# Altium project ARMflash_revC.PrjPcb (part 1 of 4)
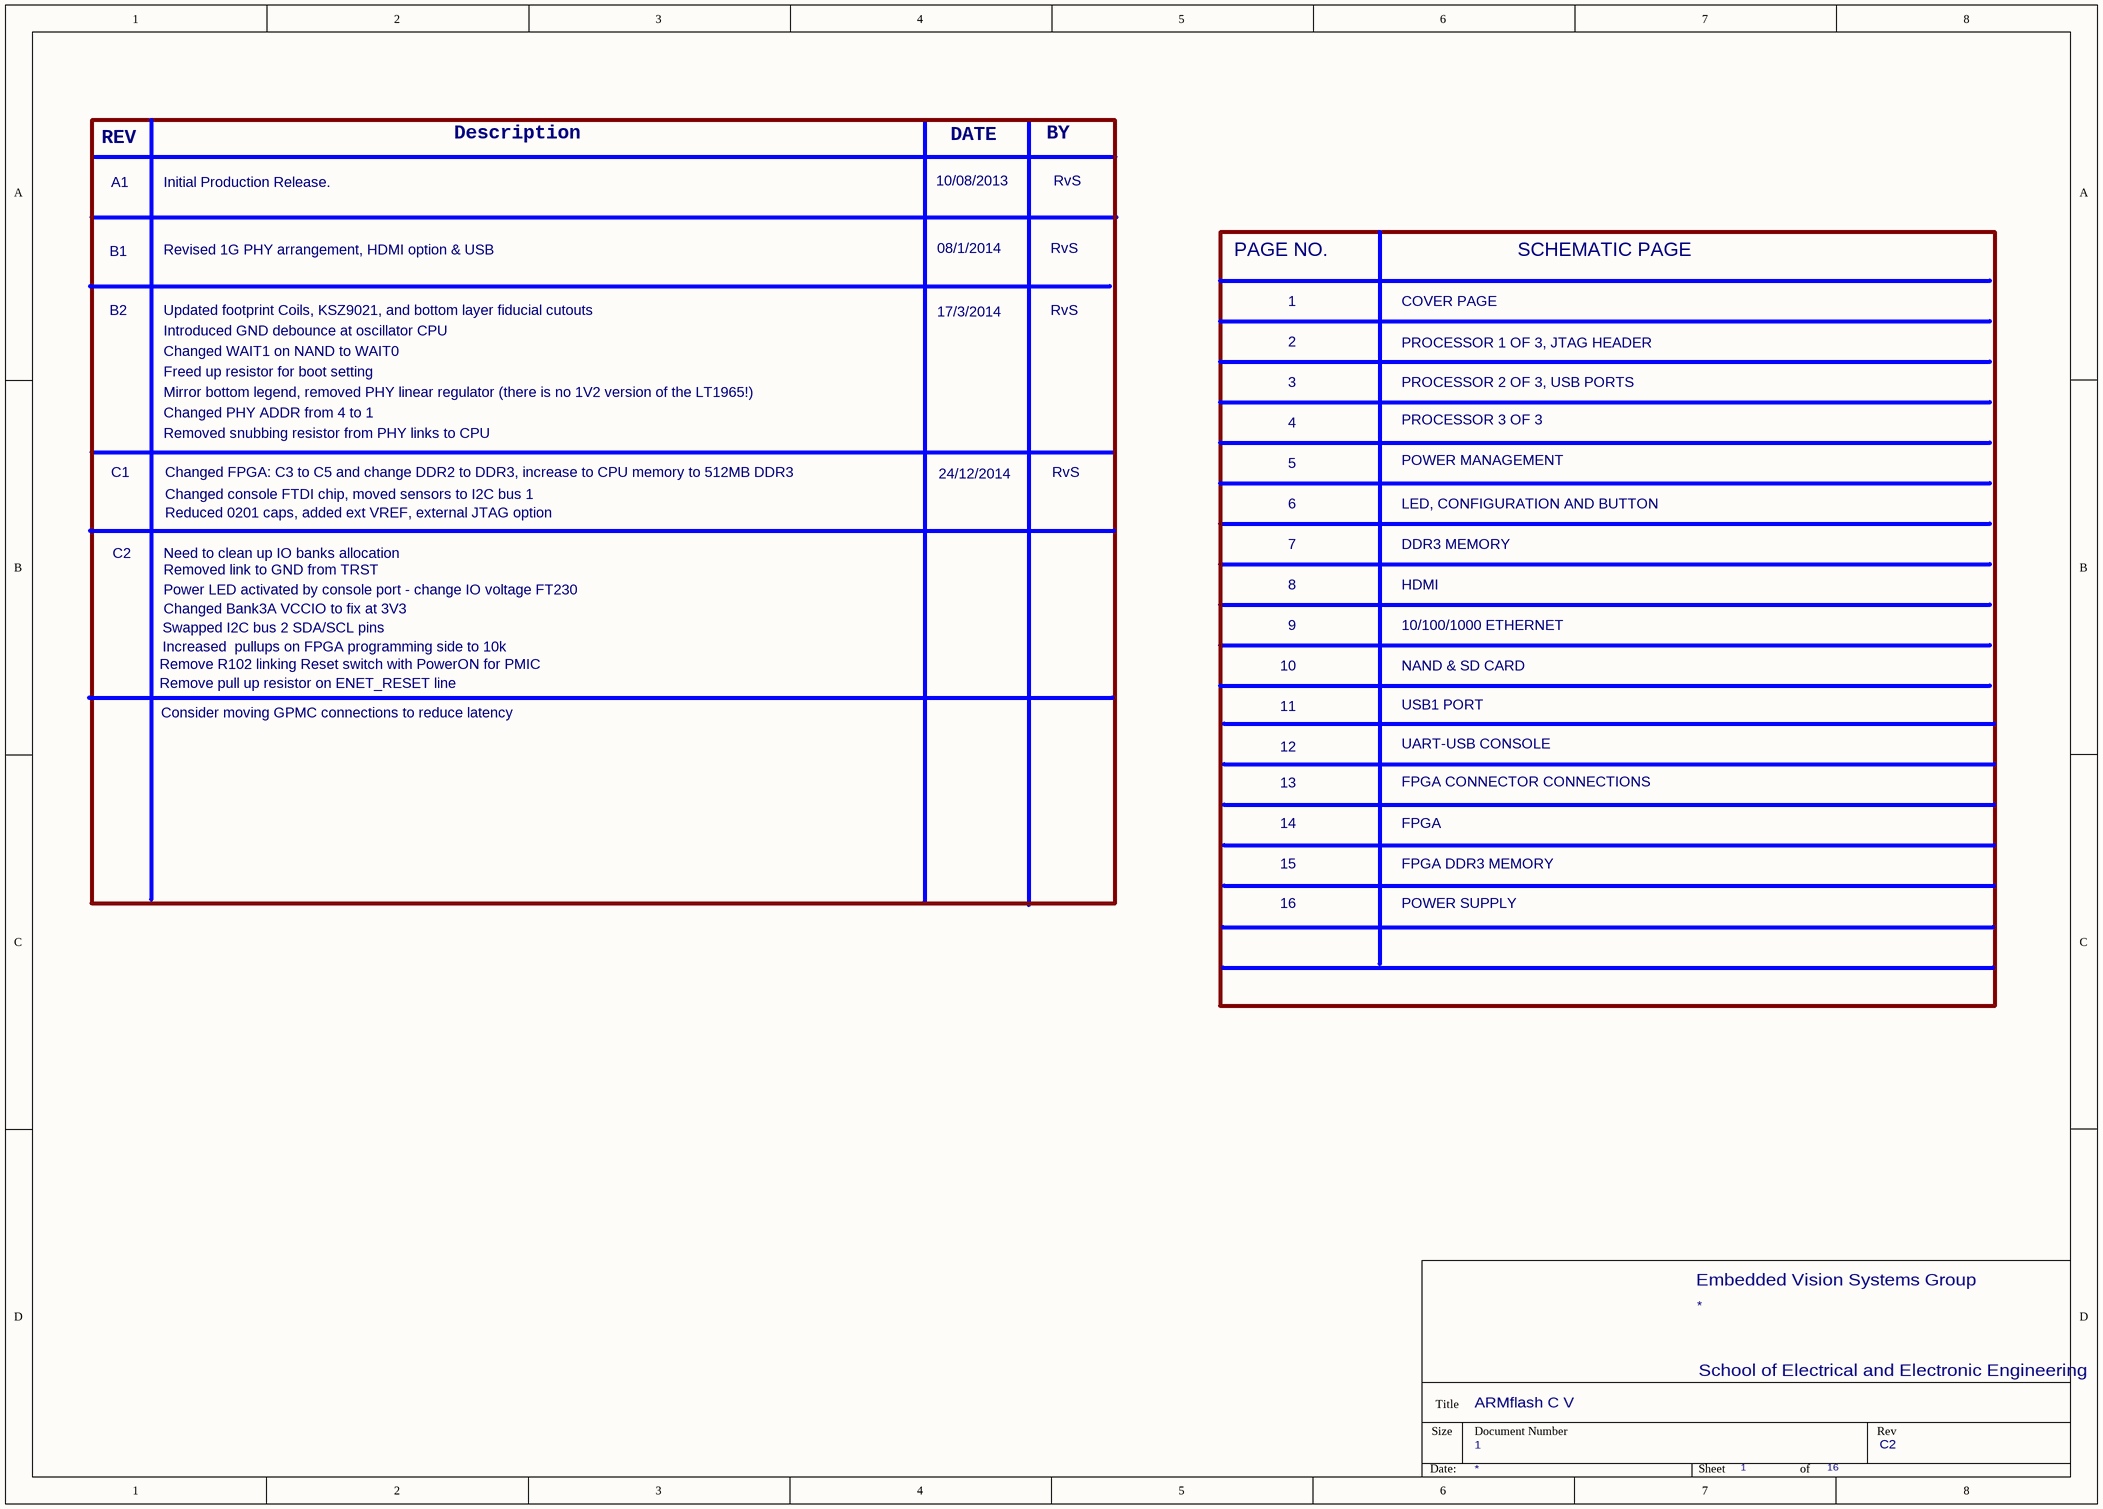
[diagram p0: Pg01_Title Page.SchDoc]
Revision: C2
16 sheets, 607 parts. Net scope: flat (ports and power ports of the same name join across sheets).
Board file: ARMflash_mini_C_V5_1.PcbDoc
Sheets:
  Pg01_Title Page.SchDoc
  Pg02_ AM335X Section 1 .SchDoc
  Pg03_ AM335X Section 2 .SchDoc
  Pg04_ AM335X Section 3 .SchDoc
  Pg05_ Platform_Power.SchDoc
  Pg06_ SysBoot_LEDS_Mech.SchDoc
  Pg07_ DDR3_Memory.SchDoc
  Pg08_HDMI.SchDoc
  Pg09_1G_b.SchDoc
  Pg10_ NAND_SDMMC Interface.SchDoc
  Pg11_ USB1.SchDoc
  Pg12_USB_UART.SchDoc
  Pg13_FPGA_Connectors.SchDoc
  Pg14_FPGA_DDR3.SchDoc
  Pg15_FPGA_5CGX.SchDoc
  Pg16_PSU.SchDoc

## Sheet Pg01_Title Page.SchDoc: ARMflash C V
size A3; DrawnBy: RvS; DocumentNumber: 1; Revision: C2; SheetNumber: 1; SheetTotal: 16

### Parts
(Parts that share a designator on the sheet are numbered #1, #2 ... from top to bottom, then left to right.)
?#1  (no value)  (graphical)

### Notes on the sheet
- REV
- Description
- DATE
- BY
- A1
- Initial Production Release.
- 10/08/2013
- RvS
- B1
- B2
- Revised 1G PHY arrangement, HDMI option & USB
- Updated footprint Coils, KSZ9021, and bottom layer fiducial cutouts
- 08/1/2014
- 17/3/2014
- PAGE NO.
- 1
- COVER PAGE
- SCHEMATIC PAGE
- Freed up resistor for boot setting
- Changed WAIT1 on NAND to WAIT0
- Introduced GND debounce at oscillator CPU
- 2
- PROCESSOR 1 OF 3, JTAG HEADER
- Mirror bottom legend, removed PHY linear regulator (there is no 1V2 version of the LT1965!)
- Changed PHY ADDR from 4 to 1
- Removed snubbing resistor from PHY links to CPU
- 3
- 4
- PROCESSOR 2 OF 3, USB PORTS
- PROCESSOR 3 OF 3
- C1
- Changed FPGA: C3 to C5 and change DDR2 to DDR3, increase to CPU memory to 512MB DDR3
- Changed console FTDI chip, moved sensors to I2C bus 1
- Reduced 0201 caps, added ext VREF, external JTAG option
- 24/12/2014
- 5
- 6
- LED, CONFIGURATION AND BUTTON
- POWER MANAGEMENT
- C2
- Need to clean up IO banks allocation
- Removed link to GND from TRST
- 7
- DDR3 MEMORY
- Swapped I2C bus 2 SDA/SCL pins
- Increased  pullups on FPGA programming side to 10k
- Power LED activated by console port - change IO voltage FT230
- Changed Bank3A VCCIO to fix at 3V3
- 8
- 9
- HDMI
- 10/100/1000 ETHERNET
- Remove R102 linking Reset switch with PowerON for PMIC
- Remove pull up resistor on ENET_RESET line
- Consider moving GPMC connections to reduce latency
- 10
- 11
- NAND & SD CARD
- USB1 PORT
- 12
- 13
- UART-USB CONSOLE
- FPGA CONNECTOR CONNECTIONS
- 14
- FPGA
- 15
- 16
- FPGA DDR3 MEMORY
- POWER SUPPLY
- Embedded Vision Systems Group
- School of Electrical and Electronic Engineering
- Size
- Title
- Document Number
- Rev
- Date:
- Sheet
- of

### Library data of the parts
?#1 = Title Block Address(1): UoM title block

## Sheet Pg02_ AM335X Section 1 .SchDoc: PROCESSOR 1 OF 1
size A2; DrawnBy: RvS; DocumentNumber: 2; Revision: C2; SheetNumber: 2; SheetTotal: 16
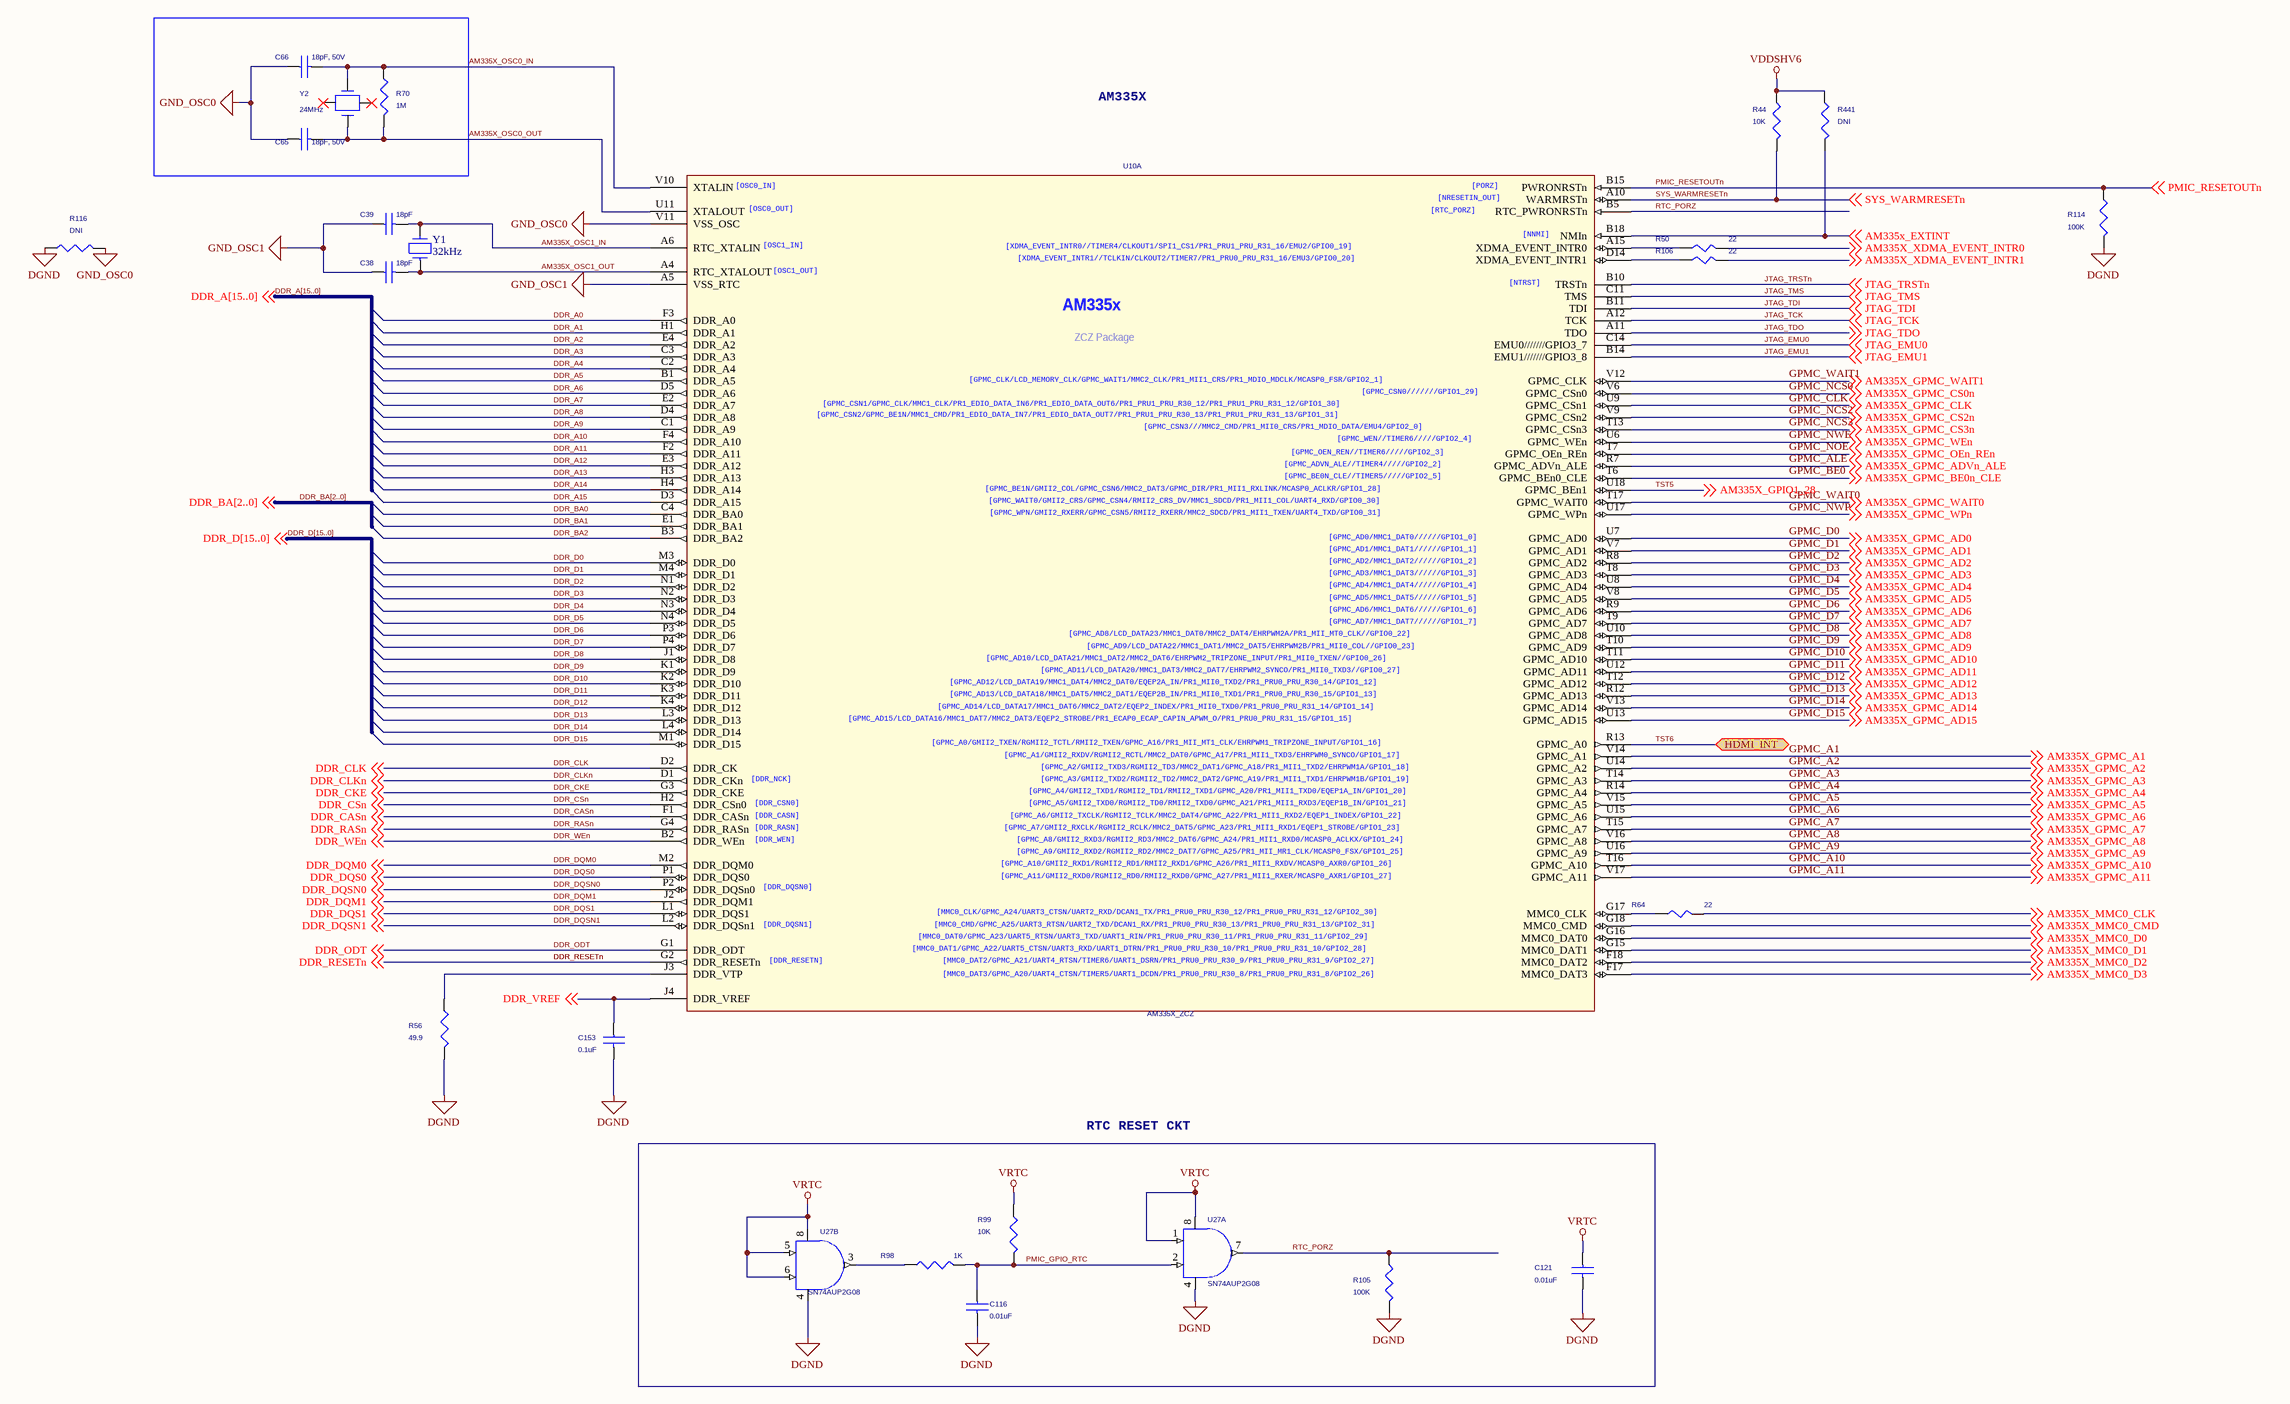
[diagram p1: Pg02_ AM335X Section 1 .SchDoc]

### Parts
(Parts that share a designator on the sheet are numbered #1, #2 ... from top to bottom, then left to right.)
?#2  (no value)  (graphical)
C38  18pF  [SM-7351-CAP-0402]
C39  18pF  [SM-7351-CAP-0402]
C65  18pF, 50V  [SM-7351-CAP-0402]
C66  18pF, 50V  [SM-7351-CAP-0402]
C116  0.01uF  [SM-7351-CAP-0402]
C121  0.01uF  [SM-7351-CAP-0402]
C153  0.1uF  [SM-7351-CAP-0402]
R44  10K  [SM-7351-RES-0402]
R50  22  [SM-7351-RES-0402]
R56  49.9  [smd_melf0102]
R64  22  [SM-7351-RES-0402]
R70  1M  [SM-7351-RES-0402]
R98  1K  [SM-7351-RES-0402]
R99  10K  [SM-7351-RES-0402]
R105  100K  [SM-7351-RES-0402]
R106  22  [SM-7351-RES-0402]
R114  100K  [SM-7351-RES-0402]
R116  DNI  [SM-7351-RES-0402]
R441  DNI  [SM-7351-RES-0402]
U10  AM335X_ZCZ  [BGA15X15-324-55M]  (part A of 3)
U27  SN74AUP2G08  [U_8_DCU]  (parts A,B of 2)
Y1  32kHz  [Xtal 3215]
Y2  24MHz  [XTAL4_3P2X2P5_SMD]

### Blocks framed on the sheet
RTC RESET CKT: C116 C121 R98 R99 R105 U27

### Ports
HDMI_INT

### Nets
DGND: C116.2 C121.2 C153.2 R56.1(P1) R105.1(P1) R114.1(P1) R116.2(P2) U27.4(GND)
GND_OSC0: C65.1 C66.1 R116.1(P1) U10.V11(VSS_OSC)
GND_OSC1: C38.1 C39.1 U10.A5(VSS_RTC)
VDDSHV6: R44.2(P2) R441.2(P2)
VRTC: C121.1 R99.2(P2) U27.1(2A) U27.5(2A) U27.6(2B) U27.8(VCC)  [project net VDDS_RTC]
AM335x_EXTINT: R441.1(P1) U10.B18(NMIn) ; off-sheet AM335x_EXTINT
AM335X_MMC0_CLK: R64.1(P1) ; off-sheet AM335X_MMC0_CLK
AM335X_MMC0_CMD: U10.G18(MMC0_CMD) ; off-sheet AM335X_MMC0_CMD
AM335X_MMC0_D0: U10.G16(MMC0_DAT0) ; off-sheet AM335X_MMC0_D0
AM335X_MMC0_D1: U10.G15(MMC0_DAT1) ; off-sheet AM335X_MMC0_D1
AM335X_MMC0_D2: U10.F18(MMC0_DAT2) ; off-sheet AM335X_MMC0_D2
AM335X_MMC0_D3: U10.F17(MMC0_DAT3) ; off-sheet AM335X_MMC0_D3
AM335X_OSC0_IN: C66.2 R70.2(P2) U10.V10(XTALIN) Y2.3
AM335X_OSC0_OUT: C65.2 R70.1(P1) U10.U11(XTALOUT) Y2.1
AM335X_OSC1_IN: C39.2 U10.A6(RTC_XTALIN) Y1.2
AM335X_OSC1_OUT: C38.2 U10.A4(RTC_XTALOUT) Y1.1
AM335X_XDMA_EVENT_INTR0: R50.1(P1) ; off-sheet AM335X_XDMA_EVENT_INTR0
AM335X_XDMA_EVENT_INTR1: R106.1(P1) ; off-sheet AM335X_XDMA_EVENT_INTR1
DDR_A0: U10.F3(DDR_A0)
DDR_A1: U10.H1(DDR_A1)
DDR_A2: U10.E4(DDR_A2)
DDR_A3: U10.C3(DDR_A3)
DDR_A4: U10.C2(DDR_A4)
DDR_A5: U10.B1(DDR_A5)
DDR_A6: U10.D5(DDR_A6)
DDR_A7: U10.E2(DDR_A7)
DDR_A8: U10.D4(DDR_A8)
DDR_A9: U10.C1(DDR_A9)
DDR_A10: U10.F4(DDR_A10)
DDR_A11: U10.F2(DDR_A11)
DDR_A12: U10.E3(DDR_A12)
DDR_A13: U10.H3(DDR_A13)
DDR_A14: U10.H4(DDR_A14)
DDR_A15: U10.D3(DDR_A15)
DDR_BA0: U10.C4(DDR_BA0)
DDR_BA1: U10.E1(DDR_BA1)
DDR_BA2: U10.B3(DDR_BA2)
DDR_CASn: U10.F1(DDR_CASn) ; off-sheet DDR_CASn
DDR_CKE: U10.G3(DDR_CKE) ; off-sheet DDR_CKE
DDR_CLK: U10.D2(DDR_CK) ; off-sheet DDR_CLK
DDR_CLKn: U10.D1(DDR_CKn) ; off-sheet DDR_CLKn
DDR_CSn: U10.H2(DDR_CSn0) ; off-sheet DDR_CSn
DDR_D0: U10.M3(DDR_D0)
DDR_D1: U10.M4(DDR_D1)
DDR_D2: U10.N1(DDR_D2)
DDR_D3: U10.N2(DDR_D3)
DDR_D4: U10.N3(DDR_D4)
DDR_D5: U10.N4(DDR_D5)
DDR_D6: U10.P3(DDR_D6)
DDR_D7: U10.P4(DDR_D7)
DDR_D8: U10.J1(DDR_D8)
DDR_D9: U10.K1(DDR_D9)
DDR_D10: U10.K2(DDR_D10)
DDR_D11: U10.K3(DDR_D11)
DDR_D12: U10.K4(DDR_D12)
DDR_D13: U10.L3(DDR_D13)
DDR_D14: U10.L4(DDR_D14)
DDR_D15: U10.M1(DDR_D15)
DDR_DQM0: U10.M2(DDR_DQM0) ; off-sheet DDR_DQM0
DDR_DQM1: U10.J2(DDR_DQM1) ; off-sheet DDR_DQM1
DDR_DQS0: U10.P1(DDR_DQS0) ; off-sheet DDR_DQS0
DDR_DQS1: U10.L1(DDR_DQS1) ; off-sheet DDR_DQS1
DDR_DQSN0: U10.P2(DDR_DQSn0) ; off-sheet DDR_DQSN0
DDR_DQSN1: U10.L2(DDR_DQSn1) ; off-sheet DDR_DQSN1
DDR_ODT: U10.G1(DDR_ODT) ; off-sheet DDR_ODT
DDR_RASn: U10.G4(DDR_RASn) ; off-sheet DDR_RASn
DDR_RESETn: U10.G2(DDR_RESETn) ; off-sheet DDR_RESETn
DDR_VREF: C153.1 U10.J4(DDR_VREF) ; off-sheet DDR_VREF
DDR_WEn: U10.B2(DDR_WEn) ; off-sheet DDR_WEn
GPMC_A1: U10.V14(GPMC_A1) ; off-sheet AM335X_GPMC_A1  [also labelled AM335X_GPMC_A1]
GPMC_A2: U10.U14(GPMC_A2) ; off-sheet AM335X_GPMC_A2  [also labelled AM335X_GPMC_A2]
GPMC_A3: U10.T14(GPMC_A3) ; off-sheet AM335X_GPMC_A3  [also labelled AM335X_GPMC_A3]
GPMC_A4: U10.R14(GPMC_A4) ; off-sheet AM335X_GPMC_A4  [also labelled AM335X_GPMC_A4]
GPMC_A5: U10.V15(GPMC_A5) ; off-sheet AM335X_GPMC_A5  [also labelled AM335X_GPMC_A5]
GPMC_A6: U10.U15(GPMC_A6) ; off-sheet AM335X_GPMC_A6  [also labelled AM335X_GPMC_A6]
GPMC_A7: U10.T15(GPMC_A7) ; off-sheet AM335X_GPMC_A7  [also labelled AM335X_GPMC_A7]
GPMC_A8: U10.V16(GPMC_A8) ; off-sheet AM335X_GPMC_A8  [also labelled AM335X_GPMC_A8]
GPMC_A9: U10.U16(GPMC_A9) ; off-sheet AM335X_GPMC_A9  [also labelled AM335X_GPMC_A9]
GPMC_A10: U10.T16(GPMC_A10) ; off-sheet AM335X_GPMC_A10  [also labelled AM335X_GPMC_A10]
GPMC_A11: U10.V17(GPMC_A11) ; off-sheet AM335X_GPMC_A11  [also labelled AM335X_GPMC_A11]
GPMC_ALE: U10.R7(GPMC_ADVn_ALE) ; off-sheet AM335X_GPMC_ADVn_ALE  [also labelled AM335X_GPMC_ADVn_ALE]
GPMC_BE0: U10.T6(GPMC_BEn0_CLE) ; off-sheet AM335X_GPMC_BE0n_CLE  [also labelled AM335X_GPMC_BE0n_CLE]
GPMC_CLK: U10.U9(GPMC_CSn1) ; off-sheet AM335X_GPMC_CLK  [also labelled AM335X_GPMC_CLK]
GPMC_D0: U10.U7(GPMC_AD0) ; off-sheet AM335X_GPMC_AD0  [also labelled AM335X_GPMC_AD0]
GPMC_D1: U10.V7(GPMC_AD1) ; off-sheet AM335X_GPMC_AD1  [also labelled AM335X_GPMC_AD1]
GPMC_D2: U10.R8(GPMC_AD2) ; off-sheet AM335X_GPMC_AD2  [also labelled AM335X_GPMC_AD2]
GPMC_D3: U10.T8(GPMC_AD3) ; off-sheet AM335X_GPMC_AD3  [also labelled AM335X_GPMC_AD3]
GPMC_D4: U10.U8(GPMC_AD4) ; off-sheet AM335X_GPMC_AD4  [also labelled AM335X_GPMC_AD4]
GPMC_D5: U10.V8(GPMC_AD5) ; off-sheet AM335X_GPMC_AD5  [also labelled AM335X_GPMC_AD5]
GPMC_D6: U10.R9(GPMC_AD6) ; off-sheet AM335X_GPMC_AD6  [also labelled AM335X_GPMC_AD6]
GPMC_D7: U10.T9(GPMC_AD7) ; off-sheet AM335X_GPMC_AD7  [also labelled AM335X_GPMC_AD7]
GPMC_D8: U10.U10(GPMC_AD8) ; off-sheet AM335X_GPMC_AD8  [also labelled AM335X_GPMC_AD8]
GPMC_D9: U10.T10(GPMC_AD9) ; off-sheet AM335X_GPMC_AD9  [also labelled AM335X_GPMC_AD9]
GPMC_D10: U10.T11(GPMC_AD10) ; off-sheet AM335X_GPMC_AD10  [also labelled AM335X_GPMC_AD10]
GPMC_D11: U10.U12(GPMC_AD11) ; off-sheet AM335X_GPMC_AD11  [also labelled AM335X_GPMC_AD11]
GPMC_D12: U10.T12(GPMC_AD12) ; off-sheet AM335X_GPMC_AD12  [also labelled AM335X_GPMC_AD12]
GPMC_D13: U10.R12(GPMC_AD13) ; off-sheet AM335X_GPMC_AD13  [also labelled AM335X_GPMC_AD13]
GPMC_D14: U10.V13(GPMC_AD14) ; off-sheet AM335X_GPMC_AD14  [also labelled AM335X_GPMC_AD14]
GPMC_D15: U10.U13(GPMC_AD15) ; off-sheet AM335X_GPMC_AD15  [also labelled AM335X_GPMC_AD15]
GPMC_NCS0: U10.V6(GPMC_CSn0) ; off-sheet AM335X_GPMC_CS0n  [also labelled AM335X_GPMC_CS0n]
GPMC_NCS2: U10.V9(GPMC_CSn2) ; off-sheet AM335X_GPMC_CS2n  [also labelled AM335X_GPMC_CS2n]
GPMC_NCS3: U10.T13(GPMC_CSn3) ; off-sheet AM335X_GPMC_CS3n  [also labelled AM335X_GPMC_CS3n]
GPMC_NOE: U10.T7(GPMC_OEn_REn) ; off-sheet AM335X_GPMC_OEn_REn  [also labelled AM335X_GPMC_OEn_REn]
GPMC_NWE: U10.U6(GPMC_WEn) ; off-sheet AM335X_GPMC_WEn  [also labelled AM335X_GPMC_WEn]
GPMC_NWP: U10.U17(GPMC_WPn) ; off-sheet AM335X_GPMC_WPn  [also labelled AM335X_GPMC_WPn]
GPMC_WAIT0: U10.T17(GPMC_WAIT0) ; off-sheet AM335X_GPMC_WAIT0  [also labelled AM335X_GPMC_WAIT0]
GPMC_WAIT1: U10.V12(GPMC_CLK) ; off-sheet AM335X_GPMC_WAIT1  [also labelled AM335X_GPMC_WAIT1]
JTAG_EMU0: U10.C14(EMU0///////GPIO3_7) ; off-sheet JTAG_EMU0
JTAG_EMU1: U10.B14(EMU1///////GPIO3_8) ; off-sheet JTAG_EMU1
JTAG_TCK: U10.A12(TCK) ; off-sheet JTAG_TCK
JTAG_TDI: U10.B11(TDI) ; off-sheet JTAG_TDI
JTAG_TDO: U10.A11(TDO) ; off-sheet JTAG_TDO
JTAG_TMS: U10.C11(TMS) ; off-sheet JTAG_TMS
JTAG_TRSTn: U10.B10(TRSTn) ; off-sheet JTAG_TRSTn
PMIC_GPIO_RTC: C116.1 R98.1(P1) R99.1(P1) U27.2(2B)
PMIC_RESETOUTn: R114.2(P2) U10.B15(PWRONRSTn) ; off-sheet PMIC_RESETOUTn
RTC_PORZ: R105.2(P2) U10.B5(RTC_PWRONRSTn) U27.7(2Y)
SYS_WARMRESETn: R44.1(P1) U10.A10(WARMRSTn) ; off-sheet SYS_WARMRESETn  [project net ENET_RESETn]
TST5: U10.U18(GPMC_BEn1) ; off-sheet AM335X_GPIO1_28  [also labelled AM335X_GPIO1_28]
TST6: U10.R13(GPMC_A0) ; port HDMI_INT
NetR50_2: R50.2(P2) U10.A15(XDMA_EVENT_INTR0)
NetR56_2: R56.2(P2) U10.J3(DDR_VTP)
NetR64_2: R64.2(P2) U10.G17(MMC0_CLK)
NetR98_2: R98.2(P2) U27.3(2Y)
NetR106_2: R106.2(P2) U10.D14(XDMA_EVENT_INTR1)

Not connected (* = marked no-connect by the designer): Y2 2(NC0)* 4(NC1)*

### Buses and harness runs
bus DDR_A[15..0]
bus DDR_BA[2..0]
bus DDR_D[15..0]

### Notes on the sheet
- AM335X
- Embedded Vision Systems Group
- Title
- School of Electrical and Electronic Engineering
- Date:
- Size
- Document Number
- Sheet
- of
- Rev
- (in symbol AM335X_15mmx15mm, part A) [OSC0_IN]; [PORZ]; [NRESETIN_OUT]; [OSC0_OUT]; [RTC_PORZ]; [NNMI]; [OSC1_IN]; [XDMA_EVENT_INTR0//TIMER4/CLKOUT1/SPI1_CS1/PR1_PRU1_PRU_R31_16/EMU2/GPIO0_19]; [XDMA_EVENT_INTR1//TCLKIN/CLKOUT2/TIMER7/PR1_PRU0_PRU_R31_16/EMU3/GPIO0_20]; [OSC1_OUT]; [NTRST]; AM335x; ZCZ Package; [GPMC_CLK/LCD_MEMORY_CLK/GPMC_WAIT1/MMC2_CLK/PR1_MII1_CRS/PR1_MDIO_MDCLK/MCASP0_FSR/GPIO2_1]; [GPMC_CSN0///////GPIO1_29]; [GPMC_CSN1/GPMC_CLK/MMC1_CLK/PR1_EDIO_DATA_IN6/PR1_EDIO_DATA_OUT6/PR1_PRU1_PRU_R30_12/PR1_PRU1_PRU_R31_12/GPIO1_30]; [GPMC_CSN2/GPMC_BE1N/MMC1_CMD/PR1_EDIO_DATA_IN7/PR1_EDIO_DATA_OUT7/PR1_PRU1_PRU_R30_13/PR1_PRU1_PRU_R31_13/GPIO1_31]; [GPMC_CSN3///MMC2_CMD/PR1_MII0_CRS/PR1_MDIO_DATA/EMU4/GPIO2_0]; [GPMC_WEN//TIMER6/////GPIO2_4]; [GPMC_OEN_REN//TIMER6/////GPIO2_3]; [GPMC_ADVN_ALE//TIMER4/////GPIO2_2]; [GPMC_BE0N_CLE//TIMER5/////GPIO2_5]; [GPMC_BE1N/GMII2_COL/GPMC_CSN6/MMC2_DAT3/GPMC_DIR/PR1_MII1_RXLINK/MCASP0_ACLKR/GPIO1_28]; [GPMC_WAIT0/GMII2_CRS/GPMC_CSN4/RMII2_CRS_DV/MMC1_SDCD/PR1_MII1_COL/UART4_RXD/GPIO0_30]; [GPMC_WPN/GMII2_RXERR/GPMC_CSN5/RMII2_RXERR/MMC2_SDCD/PR1_MII1_TXEN/UART4_TXD/GPIO0_31]; [GPMC_AD0/MMC1_DAT0//////GPIO1_0]; [GPMC_AD1/MMC1_DAT1//////GPIO1_1]; [GPMC_AD2/MMC1_DAT2//////GPIO1_2]; [GPMC_AD3/MMC1_DAT3//////GPIO1_3]; [GPMC_AD4/MMC1_DAT4//////GPIO1_4]; [GPMC_AD5/MMC1_DAT5//////GPIO1_5]; [GPMC_AD6/MMC1_DAT6//////GPIO1_6]; [GPMC_AD7/MMC1_DAT7//////GPIO1_7]; [GPMC_AD8/LCD_DATA23/MMC1_DAT0/MMC2_DAT4/EHRPWM2A/PR1_MII_MT0_CLK//GPIO0_22]; [GPMC_AD9/LCD_DATA22/MMC1_DAT1/MMC2_DAT5/EHRPWM2B/PR1_MII0_COL//GPIO0_23]; [GPMC_AD10/LCD_DATA21/MMC1_DAT2/MMC2_DAT6/EHRPWM2_TRIPZONE_INPUT/PR1_MII0_TXEN//GPIO0_26]; [GPMC_AD11/LCD_DATA20/MMC1_DAT3/MMC2_DAT7/EHRPWM2_SYNCO/PR1_MII0_TXD3//GPIO0_27]; [GPMC_AD12/LCD_DATA19/MMC1_DAT4/MMC2_DAT0/EQEP2A_IN/PR1_MII0_TXD2/PR1_PRU0_PRU_R30_14/GPIO1_12]; [GPMC_AD13/LCD_DATA18/MMC1_DAT5/MMC2_DAT1/EQEP2B_IN/PR1_MII0_TXD1/PR1_PRU0_PRU_R30_15/GPIO1_13]; [GPMC_AD14/LCD_DATA17/MMC1_DAT6/MMC2_DAT2/EQEP2_INDEX/PR1_MII0_TXD0/PR1_PRU0_PRU_R31_14/GPIO1_14]; [GPMC_AD15/LCD_DATA16/MMC1_DAT7/MMC2_DAT3/EQEP2_STROBE/PR1_ECAP0_ECAP_CAPIN_APWM_O/PR1_PRU0_PRU_R31_15/GPIO1_15]; [GPMC_A0/GMII2_TXEN/RGMII2_TCTL/RMII2_TXEN/GPMC_A16/PR1_MII_MT1_CLK/EHRPWM1_TRIPZONE_INPUT/GPIO1_16]; [GPMC_A1/GMII2_RXDV/RGMII2_RCTL/MMC2_DAT0/GPMC_A17/PR1_MII1_TXD3/EHRPWM0_SYNCO/GPIO1_17]; [GPMC_A2/GMII2_TXD3/RGMII2_TD3/MMC2_DAT1/GPMC_A18/PR1_MII1_TXD2/EHRPWM1A/GPIO1_18]; [DDR_NCK]; [GPMC_A3/GMII2_TXD2/RGMII2_TD2/MMC2_DAT2/GPMC_A19/PR1_MII1_TXD1/EHRPWM1B/GPIO1_19]; [GPMC_A4/GMII2_TXD1/RGMII2_TD1/RMII2_TXD1/GPMC_A20/PR1_MII1_TXD0/EQEP1A_IN/GPIO1_20]; [DDR_CSN0]; [GPMC_A5/GMII2_TXD0/RGMII2_TD0/RMII2_TXD0/GPMC_A21/PR1_MII1_RXD3/EQEP1B_IN/GPIO1_21]; [DDR_CASN]; [GPMC_A6/GMII2_TXCLK/RGMII2_TCLK/MMC2_DAT4/GPMC_A22/PR1_MII1_RXD2/EQEP1_INDEX/GPIO1_22]; [DDR_RASN]; [GPMC_A7/GMII2_RXCLK/RGMII2_RCLK/MMC2_DAT5/GPMC_A23/PR1_MII1_RXD1/EQEP1_STROBE/GPIO1_23]; [DDR_WEN]; [GPMC_A8/GMII2_RXD3/RGMII2_RD3/MMC2_DAT6/GPMC_A24/PR1_MII1_RXD0/MCASP0_ACLKX/GPIO1_24]; [GPMC_A9/GMII2_RXD2/RGMII2_RD2/MMC2_DAT7/GPMC_A25/PR1_MII_MR1_CLK/MCASP0_FSX/GPIO1_25]; [GPMC_A10/GMII2_RXD1/RGMII2_RD1/RMII2_RXD1/GPMC_A26/PR1_MII1_RXDV/MCASP0_AXR0/GPIO1_26]; [GPMC_A11/GMII2_RXD0/RGMII2_RD0/RMII2_RXD0/GPMC_A27/PR1_MII1_RXER/MCASP0_AXR1/GPIO1_27]; [DDR_DQSN0]; [MMC0_CLK/GPMC_A24/UART3_CTSN/UART2_RXD/DCAN1_TX/PR1_PRU0_PRU_R30_12/PR1_PRU0_PRU_R31_12/GPIO2_30]; [DDR_DQSN1]; [MMC0_CMD/GPMC_A25/UART3_RTSN/UART2_TXD/DCAN1_RX/PR1_PRU0_PRU_R30_13/PR1_PRU0_PRU_R31_13/GPIO2_31]; [MMC0_DAT0/GPMC_A23/UART5_RTSN/UART3_TXD/UART1_RIN/PR1_PRU0_PRU_R30_11/PR1_PRU0_PRU_R31_11/GPIO2_29]; [MMC0_DAT1/GPMC_A22/UART5_CTSN/UART3_RXD/UART1_DTRN/PR1_PRU0_PRU_R30_10/PR1_PRU0_PRU_R31_10/GPIO2_28]; [DDR_RESETN]; [MMC0_DAT2/GPMC_A21/UART4_RTSN/TIMER6/UART1_DSRN/PR1_PRU0_PRU_R30_9/PR1_PRU0_PRU_R31_9/GPIO2_27]; [MMC0_DAT3/GPMC_A20/UART4_CTSN/TIMER5/UART1_DCDN/PR1_PRU0_PRU_R30_8/PR1_PRU0_PRU_R31_8/GPIO2_26]

### Library data of the parts
?#2 = Title Block Address(1): UoM title block
C38 C39 = 22pFCapacitor50V10%SMD0402: Capacitor 22pF 50V 10% 0402; PartName: 22pF50V10%SMD0402; Mfr: Panasonic; MfrNum: ECJ-0EC1H220J; TIIntPartnumber: 1C0020; Vendor: Digikey; Cost100: 0.1678; DescriptiveText: Capacitor 22pF 50V 10% 0402; Cost10K: 0.1678; Descriptive_Text: Capacitor 22pF 50V 10% 0402
C65 C66 = 18pFCapacitor50V5%0402: PartName: 18pF50V5%SMD0402; Mfr: TDK; MfrNum: CGA2B2C0G1H180J; TIIntPartnumber: 1C0119; Vendor: Mouser; Cost100: 0.19; Cost10K: 0.045; DescriptiveText: Capacitor NPO 18pF 50V 5% 0402
C116 C121 = 0.01uFCapacitor16V10%0402: Mfr: Panasonic; PartName: 0.01uF16V10%SMD0402; MfrNum: ECJ-0YB1C103K; TIIntPartnumber: 1C0012; PN: 0402YC103KAT2A; TN: 207-0054-000; Vendor: Digikey; Cost100: 0.00; Cost10K: 0.015; DescriptiveText: Capacitor 0.01uF 16V 10% 0402
C153 = 0.1uFCapacitor16V10%0402_Dup1: TIIntPartnumber: 1C0089; MfrNum: C0402C104K4RACT; Mfr: Kemet; PartName: 0.1uF16V10%SMD0402; DescriptiveText: Capacitor 0.1uF 16V 10% 0402 X7R; Cost10K: 0.015; Cost100: 0.11; Vendor: Digikey
R44 R441 = 10KOhmResistor1/16W0402_Dup1: Resistor 10Kohm 1/16W 5% 0402; TIIntPartnumber: 1R0168; MfrNum: MCR01MZPJ103; Mfr: Rohm; PartName: 10Kohm1/16W5%SMD0402; Cost10K: 0.0017; Cost100: 0.03; Vendor: Digikey; Descriptive_Text: Resistor 10Kohm 1/16W 5% 0402; DescriptiveText: Resistor 10Kohm 1/16W 5% 0402
R50 R64 R106 = 22OhmResistor1/16W1%0402: Resistor 22 ohm 1/16W 1% 0402; PartName: 22ohm1/161%smd0402; Mfr: ROHM; MfrNum: MCR01MZPF22R0; TIIntPartnumber: 1R0175; Vendor: Digikey; Cost100: 0.069; Cost10K: 0.00529; DescriptiveText: Resistor 22 ohm 1/16W 1% 0402; Descriptive_Text: Resistor 22 ohm 1/16W 1% 0402
R56 = 49.9ohm1/3W1%SMDMELF0102: Mfr: Vishay; MfrNum: MMU01020C4999FB300; TIIntPartnumber: 1R0243; DescriptiveText: MELF Resistor 49.9ohm 1/3W 1% MELF0102; Vendor: Digikey; Cost100: 0.0105; Cost10K: 0.00275; PartName: 49.9ohm1/3W1%smdMELF0102
R70 R116 = 1MOhmResistor1/16W0402: PartName: 1Mohm1/16W1%SMD0402; Mfr: Stackpole Electronics; MfrNum: RMCF0402FT1M00; TIIntPartnumber: 1R0182; Vendor: Digikey; Cost100: 0.0105; Cost10K: 0.00275; DescriptiveText: Resistor 1Mohm 1/16W 1% 0402
R98 = 1KOhmResistor1/16W0402: Resistor 1Kohm 1/16W 5% 0402; PartName: 1KOHM1/16W5%SMD; Mfr: Panasonic; MfrNum: ERJ-2GEJ102X; TIIntPartnumber: 1R0027; Vendor: DIGIKEY; Cost100: 0.02595; Descriptive_Text: Resistor 1Kohm 1/16W 5% 0402; Cost10K: 0.02595; DescriptiveText: Resistor 1Kohm 1/16W 5% 0402
R99 = 10KOhmResistor1/16W0402: Resistor 10Kohm 1/16W 5% 0402; PartName: 10Kohm1/16W5%SMD0402; Mfr: Rohm; MfrNum: MCR01MZPJ103; TIIntPartnumber: 1R0168; Vendor: DIGIKEY; Cost100: 0.03; Cost10K: 0.0017; DescriptiveText: Resistor 10Kohm 1/16W 5% 0402; Descriptive_Text: Resistor 10Kohm 1/16W 5% 0402
R105 R114 = 100KOhmResistor1/16W0402: TIIntPartnumber: 1R0181; MfrNum: RMCF0402FT100K; Mfr: Stackpole Electronics; PartName: 100Kohm1/16W1%SMD0402; DescriptiveText: Resistor 100Kohm 1/16W 1% 0402; Cost10K: 0.0020; Cost100: 0.0105; Vendor: DIGIKEY
U10 = AM335X_15mmx15mm: TIIntPartnumber: 1A0242; MfrNum: XAM3359ZCZ; Mfr: TI; PartName: AM335X_15x15; Cost10K: 4.1; Cost100: 10.00; Vendor: Arrow; DescriptiveText: ARM MPU Cortex A8 Processor ZCZ Package
U27 = SN74AUP2G08: Low Power Dual AND Gate; TIIntPartnumber: 1A0249; MfrNum: SN74AUP2G08DCU; Mfr: TI; Cost10K: 0.1710; Cost100: 0.11; Vendor: Digikey; Descriptive_Text: Low Power Dual AND Gate; PartName: SN74AUP2G08; DescriptiveText: Low Power Dual AND Gate
Y1 = CRYSTAL
Y2 = Crystal24MHz18PFsmd_0: PartName: Crystal24MHz3.2x2.5; Mfr: Citizen; MfrNum: CS325-24.000MABJ-UT; TIIntPartnumber: 1Y0039; DescriptiveText: Crystal 24MHz 30ppm load cap 18pF; Vendor: Digikey; Cost100: 0.56; Cost10K: 0.50

## Sheet Pg03_ AM335X Section 2 .SchDoc: PROCESSOR 2 OF 3
size A2; DrawnBy: RvS; DocumentNumber: 3; Revision: C2; SheetNumber: 3; SheetTotal: 16; PageSetup: Record=PageOptions|CenterHorizontal=True|CenterVertical=True|PrintScale=0.51|XCorrection=1.00|YCorrection=1.00|PrintKind=1|BorderSize=5000000|LeftOffset=0|BottomOffset=0|Orientation=2|PaperLength=1000|PaperWidth=1000|Scale=100|PaperSource=15|PrintQuality=600|MediaType=1|DitherType=10|PaperKind=A4|PrintScaleMode=1
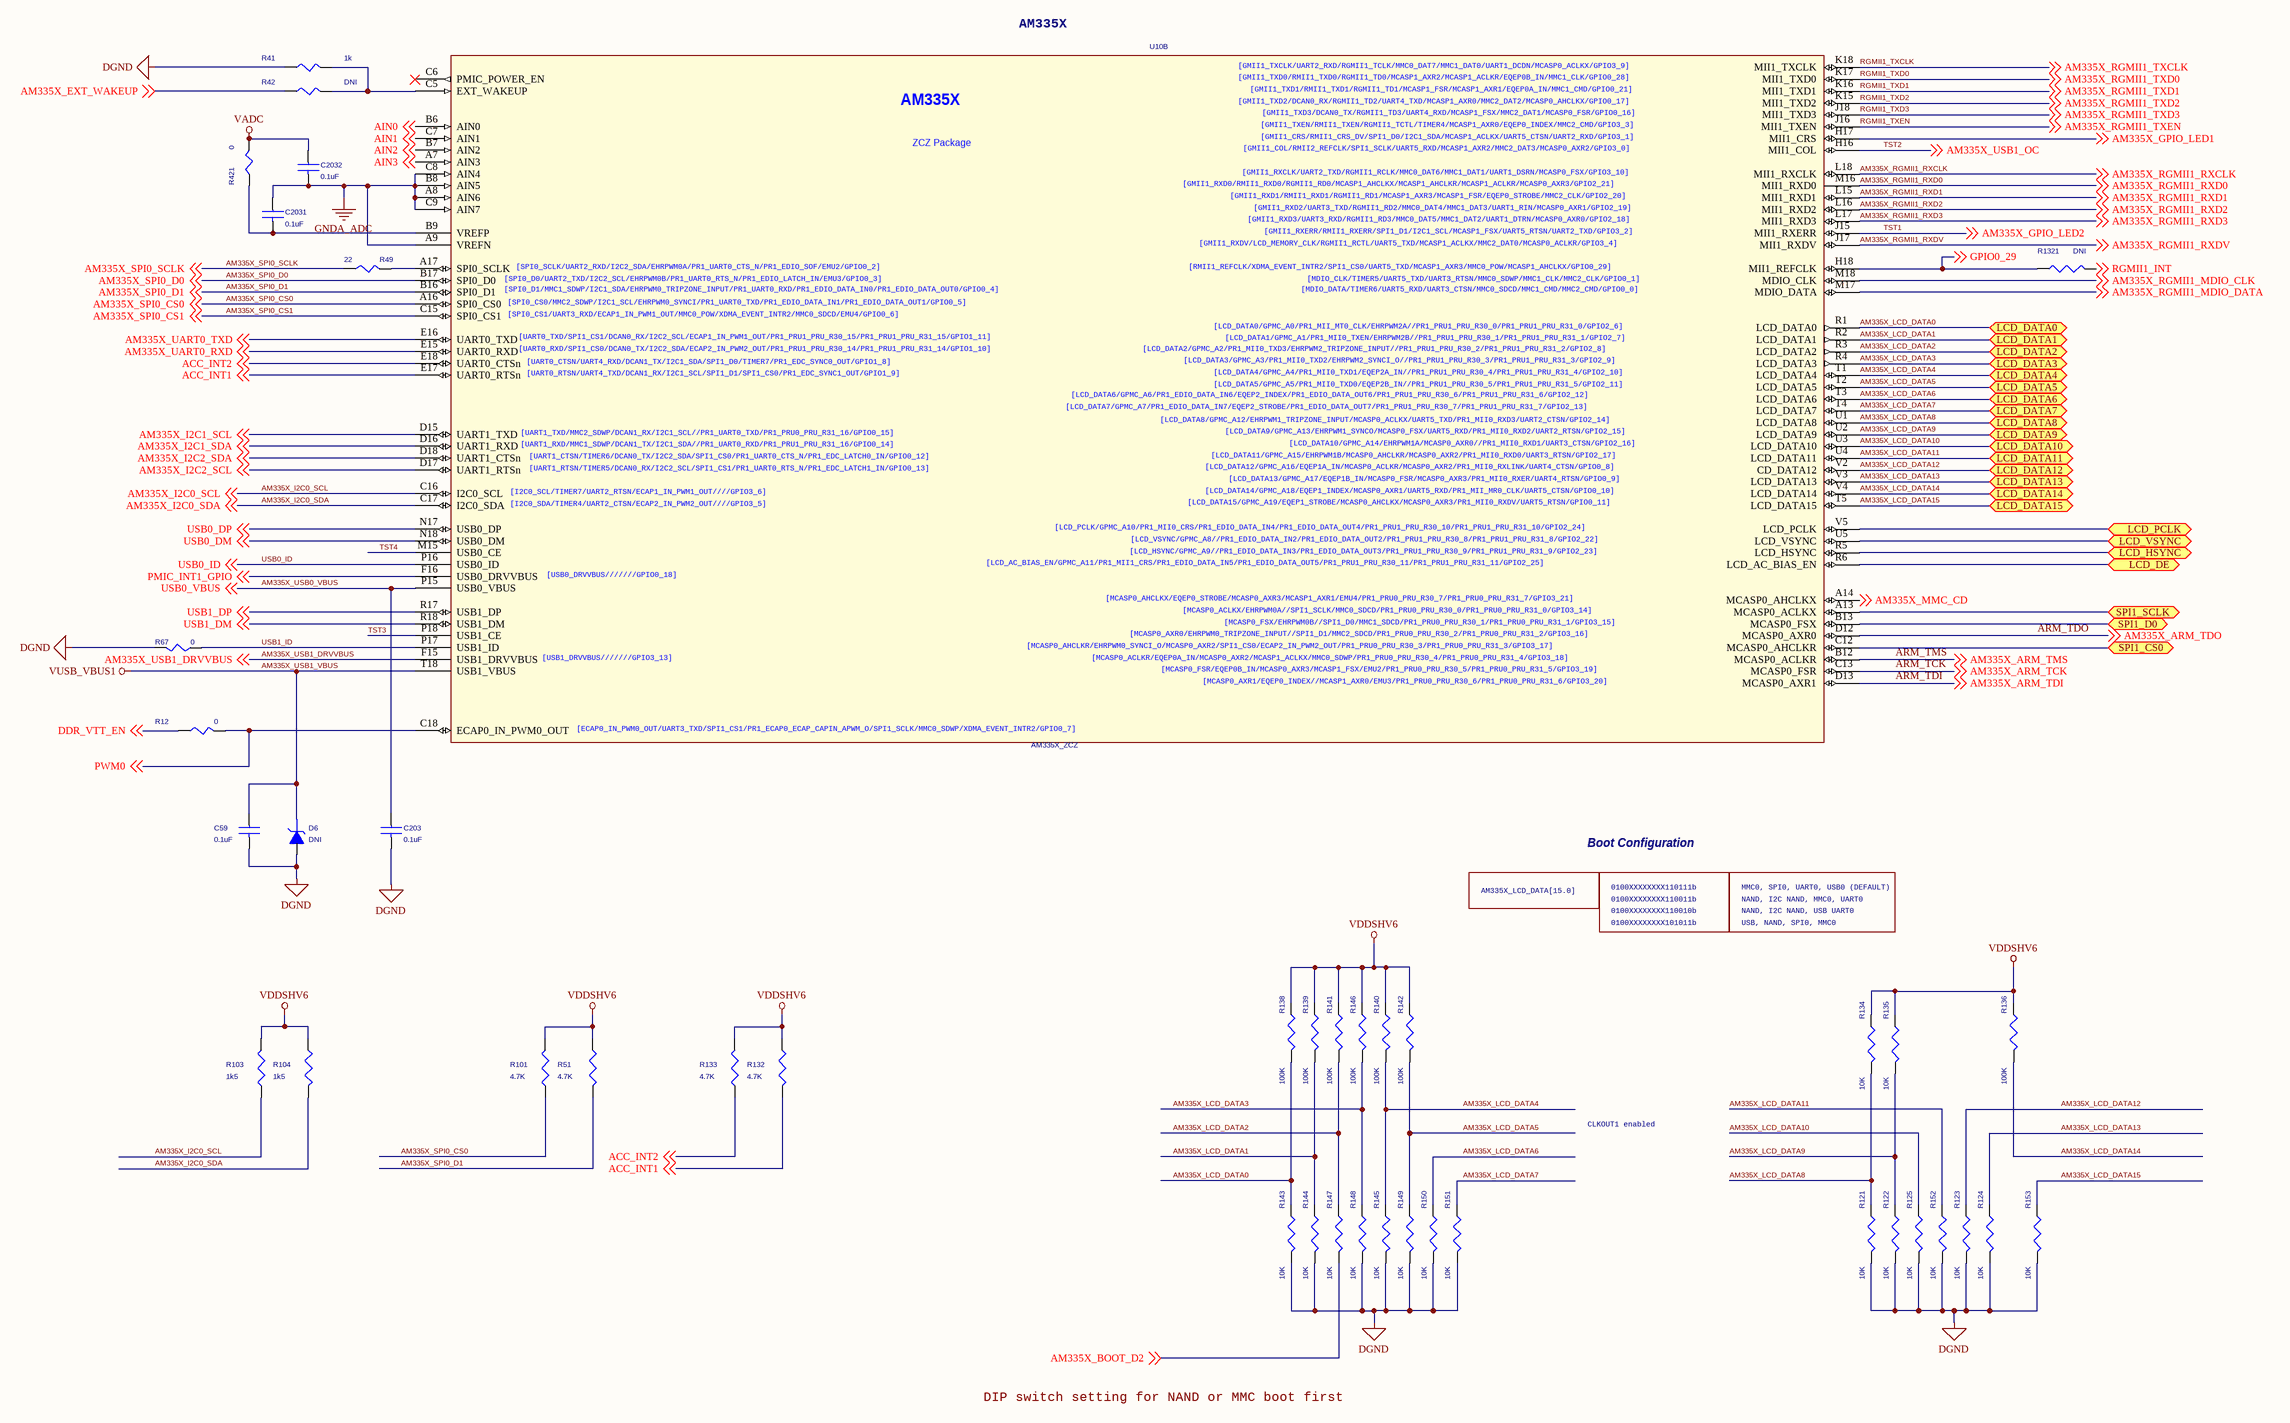
[diagram p2: Pg03_ AM335X Section 2 .SchDoc]

### Parts
(Parts that share a designator on the sheet are numbered #1, #2 ... from top to bottom, then left to right.)
?#3  (no value)  (graphical)
C59  0.1uF  [SM-7351-CAP-0402]
C203  0.1uF  [SM-7351-CAP-0402]
C2031  0.1uF  [SM-7351-CAP-0402]
C2032  0.1uF  [SM-7351-CAP-0402]
D6  DNI  [GMD2_2pin]
R12  0  [SM-7351-RES-0402]
R41  1k  [SM-7351-RES-0402]
R42  DNI  [SM-7351-RES-0402]
R49  22  [SM-7351-RES-0402]
R51  4.7K  [SM-7351-RES-0402]
R67  0  [SM-7351-RES-0402]
R101  4.7K  [SM-7351-RES-0402]
R103  1k5  [SM-7351-RES-0402]
R104  1k5  [SM-7351-RES-0402]
R121  10K  [SM-7351-RES-0402]
R122  10K  [SM-7351-RES-0402]
R123  10K  [SM-7351-RES-0402]
R124  10K  [SM-7351-RES-0402]
R125  10K  [SM-7351-RES-0402]
R132  4.7K  [SM-7351-RES-0402]
R133  4.7K  [SM-7351-RES-0402]
R134  10K  [SM-7351-RES-0402]
R135  10K  [SM-7351-RES-0402]
R136  100K  [SM-7351-RES-0402]
R138  100K  [SM-7351-RES-0402]
R139  100K  [SM-7351-RES-0402]
R140  100K  [SM-7351-RES-0402]
R141  100K  [SM-7351-RES-0402]
R142  100K  [SM-7351-RES-0402]
R143  10K  [SM-7351-RES-0402]
R144  10K  [SM-7351-RES-0402]
R145  10K  [SM-7351-RES-0402]
R146  100K  [SM-7351-RES-0402]
R147  10K  [SM-7351-RES-0402]
R148  10K  [SM-7351-RES-0402]
R149  10K  [SM-7351-RES-0402]
R150  10K  [SM-7351-RES-0402]
R151  10K  [SM-7351-RES-0402]
R152  10K  [SM-7351-RES-0402]
R153  10K  [SM-7351-RES-0402]
R421  0  [SM-7351-RES-0402]
R1321  DNI  [SM-7351-RES-0402]
U10  AM335X_ZCZ  [BGA15X15-324-55M]  (part B of 3)

### Ports
LCD_DATA0, LCD_DATA1, LCD_DATA2, LCD_DATA3, LCD_DATA4, LCD_DATA5, LCD_DATA6, LCD_DATA7, LCD_DATA8, LCD_DATA9, LCD_DATA10, LCD_DATA11, LCD_DATA12, LCD_DATA13, LCD_DATA14, LCD_DATA15, LCD_DE, LCD_HSYNC, LCD_PCLK, LCD_VSYNC, SPI1_CS0, SPI1_D0, SPI1_SCLK

### Nets
AM335X_USB1_VBUS: C59.1 D6.1(CATHODE) U10.T18(USB1_VBUS)  [also labelled VUSB_VBUS1]
DGND: C59.2 C203.2 D6.2(ANODE) R41.2(P2) R67.1(P1) R121.1(P1) R122.1(P1) R123.1(P1) R124.1(P1) R125.1(P1) R143.1(P1) R144.1(P1) R145.1(P1) R148.1(P1) R149.1(P1) R150.1(P1) R151.1(P1) R152.1(P1) R153.1(P1)
GNDA_ADC: C2031.1 C2032.2 U10.A8(AIN6) U10.A9(VREFN) U10.B8(AIN5) U10.C8(AIN4) U10.C9(AIN7)
VADC: C2032.1 R421.1(P1)
VDDSHV6: R51.2(P2) R101.2(P2) R103.2(P2) R104.2(P2) R132.2(P2) R133.2(P2) R134.2(P2) R135.2(P2) R136.2(P2) R138.2(P2) R139.2(P2) R140.2(P2) R141.2(P2) R142.2(P2) R146.2(P2)
ACC_INT1: R132.1(P1) U10.E17(UART0_RTSn) ; off-sheet ACC_INT1
ACC_INT2: R133.1(P1) U10.E18(UART0_CTSn) ; off-sheet ACC_INT2
AIN0: U10.B6(AIN0) ; off-sheet AIN0
AIN1: U10.C7(AIN1) ; off-sheet AIN1
AIN2: U10.B7(AIN2) ; off-sheet AIN2
AIN3: U10.A7(AIN3) ; off-sheet AIN3
AM335X_BOOT_D2: R147.1(P1) ; off-sheet AM335X_BOOT_D2
AM335X_EXT_WAKEUP: R42.2(P2) ; off-sheet AM335X_EXT_WAKEUP
AM335X_GPIO_LED1: U10.H17(MII1_CRS) ; off-sheet AM335X_GPIO_LED1
AM335X_I2C0_SCL: R103.1(P1) U10.C16(I2C0_SCL) ; off-sheet AM335X_I2C0_SCL
AM335X_I2C0_SDA: R104.1(P1) U10.C17(I2C0_SDA) ; off-sheet AM335X_I2C0_SDA
AM335X_I2C1_SCL: U10.D15(UART1_TXD) ; off-sheet AM335X_I2C1_SCL  [project net SCL]
AM335X_I2C1_SDA: U10.D16(UART1_RXD) ; off-sheet AM335X_I2C1_SDA  [project net SDA]
AM335X_I2C2_SCL: U10.D17(UART1_RTSn) ; off-sheet AM335X_I2C2_SCL  [project net SCL2]
AM335X_I2C2_SDA: U10.D18(UART1_CTSn) ; off-sheet AM335X_I2C2_SDA  [project net SDA2]
AM335X_LCD_DATA0: R138.1(P1) R143.2(P2) U10.R1(LCD_DATA0) ; port LCD_DATA0
AM335X_LCD_DATA1: R139.1(P1) R144.2(P2) U10.R2(LCD_DATA1) ; port LCD_DATA1
AM335X_LCD_DATA2: R141.1(P1) R147.2(P2) U10.R3(LCD_DATA2) ; port LCD_DATA2
AM335X_LCD_DATA3: R146.1(P1) R148.2(P2) U10.R4(LCD_DATA3) ; port LCD_DATA3
AM335X_LCD_DATA4: R140.1(P1) R145.2(P2) U10.T1(LCD_DATA4) ; port LCD_DATA4
AM335X_LCD_DATA5: R142.1(P1) R149.2(P2) U10.T2(LCD_DATA5) ; port LCD_DATA5
AM335X_LCD_DATA6: R150.2(P2) U10.T3(LCD_DATA6) ; port LCD_DATA6
AM335X_LCD_DATA7: R151.2(P2) U10.T4(LCD_DATA7) ; port LCD_DATA7
AM335X_LCD_DATA8: R121.2(P2) R134.1(P1) U10.U1(LCD_DATA8) ; port LCD_DATA8
AM335X_LCD_DATA9: R122.2(P2) R135.1(P1) U10.U2(LCD_DATA9) ; port LCD_DATA9
AM335X_LCD_DATA10: R125.2(P2) U10.U3(LCD_DATA10) ; port LCD_DATA10
AM335X_LCD_DATA11: R152.2(P2) U10.U4(LCD_DATA11) ; port LCD_DATA11
AM335X_LCD_DATA12: R123.2(P2) U10.V2(CD_DATA12) ; port LCD_DATA12
AM335X_LCD_DATA13: R124.2(P2) U10.V3(LCD_DATA13) ; port LCD_DATA13
AM335X_LCD_DATA14: R136.1(P1) U10.V4(LCD_DATA14) ; port LCD_DATA14
AM335X_LCD_DATA15: R153.2(P2) U10.T5(LCD_DATA15) ; port LCD_DATA15
AM335X_MMC_CD: U10.A14(MCASP0_AHCLKX) ; off-sheet AM335X_MMC_CD
AM335X_RGMII1_MDIO_CLK: U10.M18(MDIO_CLK) ; off-sheet AM335X_RGMII1_MDIO_CLK  [project net ENET_MDC]
AM335X_RGMII1_MDIO_DATA: U10.M17(MDIO_DATA) ; off-sheet AM335X_RGMII1_MDIO_DATA  [project net ENET_MDIO]
AM335X_RGMII1_RXCLK: U10.L18(MII1_RXCLK) ; off-sheet AM335X_RGMII1_RXCLK
AM335X_RGMII1_RXD0: U10.M16(MII1_RXD0) ; off-sheet AM335X_RGMII1_RXD0
AM335X_RGMII1_RXD1: U10.L15(MII1_RXD1) ; off-sheet AM335X_RGMII1_RXD1
AM335X_RGMII1_RXD2: U10.L16(MII1_RXD2) ; off-sheet AM335X_RGMII1_RXD2
AM335X_RGMII1_RXD3: U10.L17(MII1_RXD3) ; off-sheet AM335X_RGMII1_RXD3
AM335X_RGMII1_RXDV: U10.J17(MII1_RXDV) ; off-sheet AM335X_RGMII1_RXDV
AM335X_RGMII1_TXCLK: U10.K18(MII1_TXCLK) ; off-sheet AM335X_RGMII1_TXCLK  [also labelled RGMII1_TXCLK]  [project net ENET_GTX_CLK]
AM335X_RGMII1_TXD0: U10.K17(MII1_TXD0) ; off-sheet AM335X_RGMII1_TXD0  [also labelled RGMII1_TXD0]  [project net ENET_TXD0]
AM335X_RGMII1_TXD1: U10.K16(MII1_TXD1) ; off-sheet AM335X_RGMII1_TXD1  [also labelled RGMII1_TXD1]  [project net ENET_TXD1]
AM335X_RGMII1_TXD2: U10.K15(MII1_TXD2) ; off-sheet AM335X_RGMII1_TXD2  [also labelled RGMII1_TXD2]  [project net ENET_TXD2]
AM335X_RGMII1_TXD3: U10.J18(MII1_TXD3) ; off-sheet AM335X_RGMII1_TXD3  [also labelled RGMII1_TXD3]  [project net ENET_TXD3]
AM335X_RGMII1_TXEN: U10.J16(MII1_TXEN) ; off-sheet AM335X_RGMII1_TXEN  [also labelled RGMII1_TXEN]  [project net ENET_TX_EN]
AM335X_SPI0_CS0: R101.1(P1) U10.A16(SPI0_CS0) ; off-sheet AM335X_SPI0_CS0
AM335X_SPI0_CS1: U10.C15(SPI0_CS1) ; off-sheet AM335X_SPI0_CS1
AM335X_SPI0_D0: U10.B17(SPI0_D0) ; off-sheet AM335X_SPI0_D0
AM335X_SPI0_D1: R51.1(P1) U10.B16(SPI0_D1) ; off-sheet AM335X_SPI0_D1
AM335X_SPI0_SCLK: R49.2(P2) ; off-sheet AM335X_SPI0_SCLK
AM335X_UART0_RXD: U10.E15(UART0_RXD) ; off-sheet AM335X_UART0_RXD
AM335X_UART0_TXD: U10.E16(UART0_TXD) ; off-sheet AM335X_UART0_TXD
AM335X_USB0_VBUS: C203.1 U10.P15(USB0_VBUS) ; off-sheet USB0_VBUS  [also labelled USB0_VBUS]
AM335X_USB1_DRVVBUS: U10.F15(USB1_DRVVBUS) ; off-sheet AM335X_USB1_DRVVBUS
ARM_TCK: U10.C13(MCASP0_FSR) ; off-sheet AM335X_ARM_TCK  [also labelled AM335X_ARM_TCK]
ARM_TDI: U10.D13(MCASP0_AXR1) ; off-sheet AM335X_ARM_TDI  [also labelled AM335X_ARM_TDI]
ARM_TDO: U10.D12(MCASP0_AXR0) ; off-sheet AM335X_ARM_TDO  [also labelled AM335X_ARM_TDO]
ARM_TMS: U10.B12(MCASP0_ACLKR) ; off-sheet AM335X_ARM_TMS  [also labelled AM335X_ARM_TMS]
DDR_VTT_EN: R12.2(P2) ; off-sheet DDR_VTT_EN
GPIO0_29: R1321.2(P2) U10.H18(MII1_REFCLK) ; off-sheet GPIO0_29
LCD_DE: U10.R6(LCD_AC_BIAS_EN) ; port LCD_DE
LCD_HSYNC: U10.R5(LCD_HSYNC) ; port LCD_HSYNC
LCD_PCLK: U10.V5(LCD_PCLK) ; port LCD_PCLK
LCD_VSYNC: U10.U5(LCD_VSYNC) ; port LCD_VSYNC
PMIC_INT1_GPIO: U10.F16(USB0_DRVVBUS) ; off-sheet PMIC_INT1_GPIO
PWM0: R12.1(P1) U10.C18(ECAP0_IN_PWM0_OUT) ; off-sheet PWM0
RGMII1_INT: R1321.1(P1) ; off-sheet RGMII1_INT  [project net ENET_INTn]
TST1: U10.J15(MII1_RXERR) ; off-sheet AM335X_GPIO_LED2  [also labelled AM335X_GPIO_LED2]
TST2: U10.H16(MII1_COL) ; off-sheet AM335X_USB1_OC  [also labelled AM335X_USB1_OC]
TST3: U10.P18(USB1_CE)
TST4: U10.M15(USB0_CE)
USB0_DM: U10.N18(USB0_DM) ; off-sheet USB0_DM
USB0_DP: U10.N17(USB0_DP) ; off-sheet USB0_DP
USB0_ID: U10.P16(USB0_ID) ; off-sheet USB0_ID
USB1_DM: U10.R18(USB1_DM) ; off-sheet USB1_DM
USB1_DP: U10.R17(USB1_DP) ; off-sheet USB1_DP
USB1_ID: R67.2(P2) U10.P17(USB1_ID)
NetC2031_2: C2031.2 R421.2(P2) U10.B9(VREFP)
NetJ6_17: U10.A13(MCASP0_ACLKX) ; port SPI1_SCLK
NetJ6_21: U10.C12(MCASP0_AHCLKR) ; port SPI1_CS0
NetJ6_22: U10.B13(MCASP0_FSX) ; port SPI1_D0
NetR41_1: R41.1(P1) R42.1(P1) U10.C5(EXT_WAKEUP)
NetR49_1: R49.1(P1) U10.A17(SPI0_SCLK)

Not connected (* = marked no-connect by the designer): U10 C6(PMIC_POWER_EN)*

### Notes on the sheet
- (near U10) AM335X
- Boot Configuration
- AM335X_LCD_DATA[15.0]
- 0100XXXXXXXX110111b
- 0100XXXXXXXX110011b
- 0100XXXXXXXX110010b
- 0100XXXXXXXX101011b
- MMC0, SPI0, UART0, USB0 (DEFAULT)
- NAND, I2C NAND, MMC0, UART0
- NAND, I2C NAND, USB UART0
- USB, NAND, SPI0, MMC0
- CLKOUT1 enabled
- DIP switch setting for NAND or MMC boot first
- Embedded Vision Systems Group
- Title
- School of Electrical and Electronic Engineering
- Date:
- Size
- Document Number
- Sheet
- of
- Rev
- (in symbol AM335X_15mmx15mm, part B) [GMII1_TXCLK/UART2_RXD/RGMII1_TCLK/MMC0_DAT7/MMC1_DAT0/UART1_DCDN/MCASP0_ACLKX/GPIO3_9]; [GMII1_TXD0/RMII1_TXD0/RGMII1_TD0/MCASP1_AXR2/MCASP1_ACLKR/EQEP0B_IN/MMC1_CLK/GPIO0_28]; [GMII1_TXD1/RMII1_TXD1/RGMII1_TD1/MCASP1_FSR/MCASP1_AXR1/EQEP0A_IN/MMC1_CMD/GPIO0_21]; AM335X; [GMII1_TXD2/DCAN0_RX/RGMII1_TD2/UART4_TXD/MCASP1_AXR0/MMC2_DAT2/MCASP0_AHCLKX/GPIO0_17]; [GMII1_TXD3/DCAN0_TX/RGMII1_TD3/UART4_RXD/MCASP1_FSX/MMC2_DAT1/MCASP0_FSR/GPIO0_16]; [GMII1_TXEN/RMII1_TXEN/RGMII1_TCTL/TIMER4/MCASP1_AXR0/EQEP0_INDEX/MMC2_CMD/GPIO3_3]; [GMII1_CRS/RMII1_CRS_DV/SPI1_D0/I2C1_SDA/MCASP1_ACLKX/UART5_CTSN/UART2_RXD/GPIO3_1]; ZCZ Package; [GMII1_COL/RMII2_REFCLK/SPI1_SCLK/UART5_RXD/MCASP1_AXR2/MMC2_DAT3/MCASP0_AXR2/GPIO3_0]; [GMII1_RXCLK/UART2_TXD/RGMII1_RCLK/MMC0_DAT6/MMC1_DAT1/UART1_DSRN/MCASP0_FSX/GPIO3_10]; [GMII1_RXD0/RMII1_RXD0/RGMII1_RD0/MCASP1_AHCLKX/MCASP1_AHCLKR/MCASP1_ACLKR/MCASP0_AXR3/GPIO2_21]; [GMII1_RXD1/RMII1_RXD1/RGMII1_RD1/MCASP1_AXR3/MCASP1_FSR/EQEP0_STROBE/MMC2_CLK/GPIO2_20]; [GMII1_RXD2/UART3_TXD/RGMII1_RD2/MMC0_DAT4/MMC1_DAT3/UART1_RIN/MCASP0_AXR1/GPIO2_19]; [GMII1_RXD3/UART3_RXD/RGMII1_RD3/MMC0_DAT5/MMC1_DAT2/UART1_DTRN/MCASP0_AXR0/GPIO2_18]; [GMII1_RXERR/RMII1_RXERR/SPI1_D1/I2C1_SCL/MCASP1_FSX/UART5_RTSN/UART2_TXD/GPIO3_2]; [GMII1_RXDV/LCD_MEMORY_CLK/RGMII1_RCTL/UART5_TXD/MCASP1_ACLKX/MMC2_DAT0/MCASP0_ACLKR/GPIO3_4]; [SPI0_SCLK/UART2_RXD/I2C2_SDA/EHRPWM0A/PR1_UART0_CTS_N/PR1_EDIO_SOF/EMU2/GPIO0_2]; [RMII1_REFCLK/XDMA_EVENT_INTR2/SPI1_CS0/UART5_TXD/MCASP1_AXR3/MMC0_POW/MCASP1_AHCLKX/GPIO0_29]; [SPI0_D0/UART2_TXD/I2C2_SCL/EHRPWM0B/PR1_UART0_RTS_N/PR1_EDIO_LATCH_IN/EMU3/GPIO0_3]; [MDIO_CLK/TIMER5/UART5_TXD/UART3_RTSN/MMC0_SDWP/MMC1_CLK/MMC2_CLK/GPIO0_1]; [SPI0_D1/MMC1_SDWP/I2C1_SDA/EHRPWM0_TRIPZONE_INPUT/PR1_UART0_RXD/PR1_EDIO_DATA_IN0/PR1_EDIO_DATA_OUT0/GPIO0_4]; [MDIO_DATA/TIMER6/UART5_RXD/UART3_CTSN/MMC0_SDCD/MMC1_CMD/MMC2_CMD/GPIO0_0]; [SPI0_CS0/MMC2_SDWP/I2C1_SCL/EHRPWM0_SYNCI/PR1_UART0_TXD/PR1_EDIO_DATA_IN1/PR1_EDIO_DATA_OUT1/GPIO0_5]; [SPI0_CS1/UART3_RXD/ECAP1_IN_PWM1_OUT/MMC0_POW/XDMA_EVENT_INTR2/MMC0_SDCD/EMU4/GPIO0_6]; [LCD_DATA0/GPMC_A0/PR1_MII_MT0_CLK/EHRPWM2A//PR1_PRU1_PRU_R30_0/PR1_PRU1_PRU_R31_0/GPIO2_6]; [UART0_TXD/SPI1_CS1/DCAN0_RX/I2C2_SCL/ECAP1_IN_PWM1_OUT/PR1_PRU1_PRU_R30_15/PR1_PRU1_PRU_R31_15/GPIO1_11]; [LCD_DATA1/GPMC_A1/PR1_MII0_TXEN/EHRPWM2B//PR1_PRU1_PRU_R30_1/PR1_PRU1_PRU_R31_1/GPIO2_7]; [UART0_RXD/SPI1_CS0/DCAN0_TX/I2C2_SDA/ECAP2_IN_PWM2_OUT/PR1_PRU1_PRU_R30_14/PR1_PRU1_PRU_R31_14/GPIO1_10]; [LCD_DATA2/GPMC_A2/PR1_MII0_TXD3/EHRPWM2_TRIPZONE_INPUT//PR1_PRU1_PRU_R30_2/PR1_PRU1_PRU_R31_2/GPIO2_8]; [LCD_DATA3/GPMC_A3/PR1_MII0_TXD2/EHRPWM2_SYNCI_O//PR1_PRU1_PRU_R30_3/PR1_PRU1_PRU_R31_3/GPIO2_9]; [UART0_CTSN/UART4_RXD/DCAN1_TX/I2C1_SDA/SPI1_D0/TIMER7/PR1_EDC_SYNC0_OUT/GPIO1_8]; [LCD_DATA4/GPMC_A4/PR1_MII0_TXD1/EQEP2A_IN//PR1_PRU1_PRU_R30_4/PR1_PRU1_PRU_R31_4/GPIO2_10]; [UART0_RTSN/UART4_TXD/DCAN1_RX/I2C1_SCL/SPI1_D1/SPI1_CS0/PR1_EDC_SYNC1_OUT/GPIO1_9]; [LCD_DATA5/GPMC_A5/PR1_MII0_TXD0/EQEP2B_IN//PR1_PRU1_PRU_R30_5/PR1_PRU1_PRU_R31_5/GPIO2_11]; [LCD_DATA6/GPMC_A6/PR1_EDIO_DATA_IN6/EQEP2_INDEX/PR1_EDIO_DATA_OUT6/PR1_PRU1_PRU_R30_6/PR1_PRU1_PRU_R31_6/GPIO2_12]; [LCD_DATA7/GPMC_A7/PR1_EDIO_DATA_IN7/EQEP2_STROBE/PR1_EDIO_DATA_OUT7/PR1_PRU1_PRU_R30_7/PR1_PRU1_PRU_R31_7/GPIO2_13]; [LCD_DATA8/GPMC_A12/EHRPWM1_TRIPZONE_INPUT/MCASP0_ACLKX/UART5_TXD/PR1_MII0_RXD3/UART2_CTSN/GPIO2_14]; [LCD_DATA9/GPMC_A13/EHRPWM1_SYNCO/MCASP0_FSX/UART5_RXD/PR1_MII0_RXD2/UART2_RTSN/GPIO2_15]; [UART1_TXD/MMC2_SDWP/DCAN1_RX/I2C1_SCL//PR1_UART0_TXD/PR1_PRU0_PRU_R31_16/GPIO0_15]; [LCD_DATA10/GPMC_A14/EHRPWM1A/MCASP0_AXR0//PR1_MII0_RXD1/UART3_CTSN/GPIO2_16]; [UART1_RXD/MMC1_SDWP/DCAN1_TX/I2C1_SDA//PR1_UART0_RXD/PR1_PRU1_PRU_R31_16/GPIO0_14]; [LCD_DATA11/GPMC_A15/EHRPWM1B/MCASP0_AHCLKR/MCASP0_AXR2/PR1_MII0_RXD0/UART3_RTSN/GPIO2_17]; [UART1_CTSN/TIMER6/DCAN0_TX/I2C2_SDA/SPI1_CS0/PR1_UART0_CTS_N/PR1_EDC_LATCH0_IN/GPIO0_12]; [LCD_DATA12/GPMC_A16/EQEP1A_IN/MCASP0_ACLKR/MCASP0_AXR2/PR1_MII0_RXLINK/UART4_CTSN/GPIO0_8]; [UART1_RTSN/TIMER5/DCAN0_RX/I2C2_SCL/SPI1_CS1/PR1_UART0_RTS_N/PR1_EDC_LATCH1_IN/GPIO0_13]; [LCD_DATA13/GPMC_A17/EQEP1B_IN/MCASP0_FSR/MCASP0_AXR3/PR1_MII0_RXER/UART4_RTSN/GPIO0_9]; [LCD_DATA14/GPMC_A18/EQEP1_INDEX/MCASP0_AXR1/UART5_RXD/PR1_MII_MR0_CLK/UART5_CTSN/GPIO0_10]; [I2C0_SCL/TIMER7/UART2_RTSN/ECAP1_IN_PWM1_OUT////GPIO3_6]; [LCD_DATA15/GPMC_A19/EQEP1_STROBE/MCASP0_AHCLKX/MCASP0_AXR3/PR1_MII0_RXDV/UART5_RTSN/GPIO0_11]; [I2C0_SDA/TIMER4/UART2_CTSN/ECAP2_IN_PWM2_OUT////GPIO3_5]; [LCD_PCLK/GPMC_A10/PR1_MII0_CRS/PR1_EDIO_DATA_IN4/PR1_EDIO_DATA_OUT4/PR1_PRU1_PRU_R30_10/PR1_PRU1_PRU_R31_10/GPIO2_24]; [LCD_VSYNC/GPMC_A8//PR1_EDIO_DATA_IN2/PR1_EDIO_DATA_OUT2/PR1_PRU1_PRU_R30_8/PR1_PRU1_PRU_R31_8/GPIO2_22]; [LCD_HSYNC/GPMC_A9//PR1_EDIO_DATA_IN3/PR1_EDIO_DATA_OUT3/PR1_PRU1_PRU_R30_9/PR1_PRU1_PRU_R31_9/GPIO2_23]; [LCD_AC_BIAS_EN/GPMC_A11/PR1_MII1_CRS/PR1_EDIO_DATA_IN5/PR1_EDIO_DATA_OUT5/PR1_PRU1_PRU_R30_11/PR1_PRU1_PRU_R31_11/GPIO2_25]; [USB0_DRVVBUS///////GPIO0_18]; [MCASP0_AHCLKX/EQEP0_STROBE/MCASP0_AXR3/MCASP1_AXR1/EMU4/PR1_PRU0_PRU_R30_7/PR1_PRU0_PRU_R31_7/GPIO3_21]; [MCASP0_ACLKX/EHRPWM0A//SPI1_SCLK/MMC0_SDCD/PR1_PRU0_PRU_R30_0/PR1_PRU0_PRU_R31_0/GPIO3_14]; [MCASP0_FSX/EHRPWM0B//SPI1_D0/MMC1_SDCD/PR1_PRU0_PRU_R30_1/PR1_PRU0_PRU_R31_1/GPIO3_15]; [MCASP0_AXR0/EHRPWM0_TRIPZONE_INPUT//SPI1_D1/MMC2_SDCD/PR1_PRU0_PRU_R30_2/PR1_PRU0_PRU_R31_2/GPIO3_16]; [MCASP0_AHCLKR/EHRPWM0_SYNCI_O/MCASP0_AXR2/SPI1_CS0/ECAP2_IN_PWM2_OUT/PR1_PRU0_PRU_R30_3/PR1_PRU0_PRU_R31_3/GPIO3_17]; [USB1_DRVVBUS///////GPIO3_13]; [MCASP0_ACLKR/EQEP0A_IN/MCASP0_AXR2/MCASP1_ACLKX/MMC0_SDWP/PR1_PRU0_PRU_R30_4/PR1_PRU0_PRU_R31_4/GPIO3_18]; [MCASP0_FSR/EQEP0B_IN/MCASP0_AXR3/MCASP1_FSX/EMU2/PR1_PRU0_PRU_R30_5/PR1_PRU0_PRU_R31_5/GPIO3_19]; [MCASP0_AXR1/EQEP0_INDEX//MCASP1_AXR0/EMU3/PR1_PRU0_PRU_R30_6/PR1_PRU0_PRU_R31_6/GPIO3_20]; [ECAP0_IN_PWM0_OUT/UART3_TXD/SPI1_CS1/PR1_ECAP0_ECAP_CAPIN_APWM_O/SPI1_SCLK/MMC0_SDWP/XDMA_EVENT_INTR2/GPIO0_7]

### Library data of the parts
?#3 = Title Block Address(1): UoM title block
C59 C203 C2031 C2032 = 0.1uFCapacitor16V10%0402_Dup1: as C153 on sheet Pg02_ AM335X Section 1 
D6 = Diode_Zener_5.1V_100mW: Voltage Surpressor 15.0V; PartName: DiodeZener5.1V_100mW; Mfr: Rohm; MfrNum: GDZT2R5.1; TIIntPartnumber: 1E0020; DescriptiveText: Diode Zener 5.1V 100mW; Vendor: Digikey; Cost100: 0.149; Cost10K: 0.068; Descriptive_Text: Voltage Surpressor 15.0V
R12 = ZeroOhmResistor1/16W0402: PartName: ZeroohmSMD0402; Mfr: Panasonic; MfrNum: ERJ-2GE0R00X; TIIntPartnumber: 1R0098; DescriptiveText: Resistor Zero ohm Jumper 0402; Vendor: Digikey; Cost100: 0.08; Cost10K: 0.0020
R41 R42 R421 = ZeroOhmResistor1/16W0402_Dup2: Resistor Zero ohm Jumper 0402; PartName: ZeroohmSMD0402; Mfr: Panasonic; MfrNum: ERJ-2GE0R00X; TIIntPartnumber: 1R0098; Vendor: DIGIKEY; Cost100: 0.08; Cost10K: 0.0020; DescriptiveText: Resistor Zero ohm Jumper 0402; Descriptive_Text: Resistor Zero ohm Jumper 0402
R49 = 22OhmResistor1/16W1%0402: as R50 on sheet Pg02_ AM335X Section 1 ; DescriptiveText: Resistor 22 ohm 1/16W 1% 0402; Descriptive_Text: Resistor 22 ohm 1/16W 1% 0402
R51 R101 R103 R104 R132 R133 R1321 = 4.7KOhmResistor1/16W0402_Dup1: Resistor 4.7Kohm 1/16W 5% 0402; TIIntPartnumber: 1R0183; MfrNum: RMCF0402JT4K70; Mfr: Stackpole Electronics; PartName: 4.7Kohm1/16W5%smd0402; Cost10K: 0.02465; Cost100: 0.007; Vendor: Digikey; DescriptiveText: Resistor 4.7Kohm 1/16W 5% 0402; Descriptive_Text: Resistor 4.7Kohm 1/16W 5% 0402
R67 = ZeroOhmResistor1/16W0402_Dup4: Resistor Zero ohm Jumper 0402; TIIntPartnumber: 1R0098; MfrNum: ERJ-2GE0R00X; Mfr: Panasonic; PartName: ZeroohmSMD0402; Cost10K: 0.0020; Cost100: 0.08; Vendor: Digikey; Descriptive_Text: Resistor Zero ohm Jumper 0402; DescriptiveText: Resistor Zero ohm Jumper 0402
R121-R125 R134 R135 R143-R145 R147-R153 = 10KOhmResistor1/16W0402_Dup1: as R44 on sheet Pg02_ AM335X Section 1 ; Descriptive_Text: Resistor 10Kohm 1/16W 5% 0402; DescriptiveText: Resistor 10Kohm 1/16W 5% 0402
R136 R138-R142 R146 = 100KOhmResistor1/16W0402_Dup1: TIIntPartnumber: 1R0181; MfrNum: RMCF0402FT100K; Mfr: Stackpole Electronics; PartName: 100Kohm1/16W1%SMD0402; DescriptiveText: Resistor 100Kohm 1/16W 1% 0402; Cost10K: 0.0020; Cost100: 0.0105; Vendor: Digikey
U10 = AM335X_15mmx15mm: as U10 on sheet Pg02_ AM335X Section 1 

## Sheet Pg04_ AM335X Section 3 .SchDoc: PROCESSOR 3 OF 3
size A2; DrawnBy: RvS; DocumentNumber: 4; Revision: C2; SheetNumber: 4; SheetTotal: 16
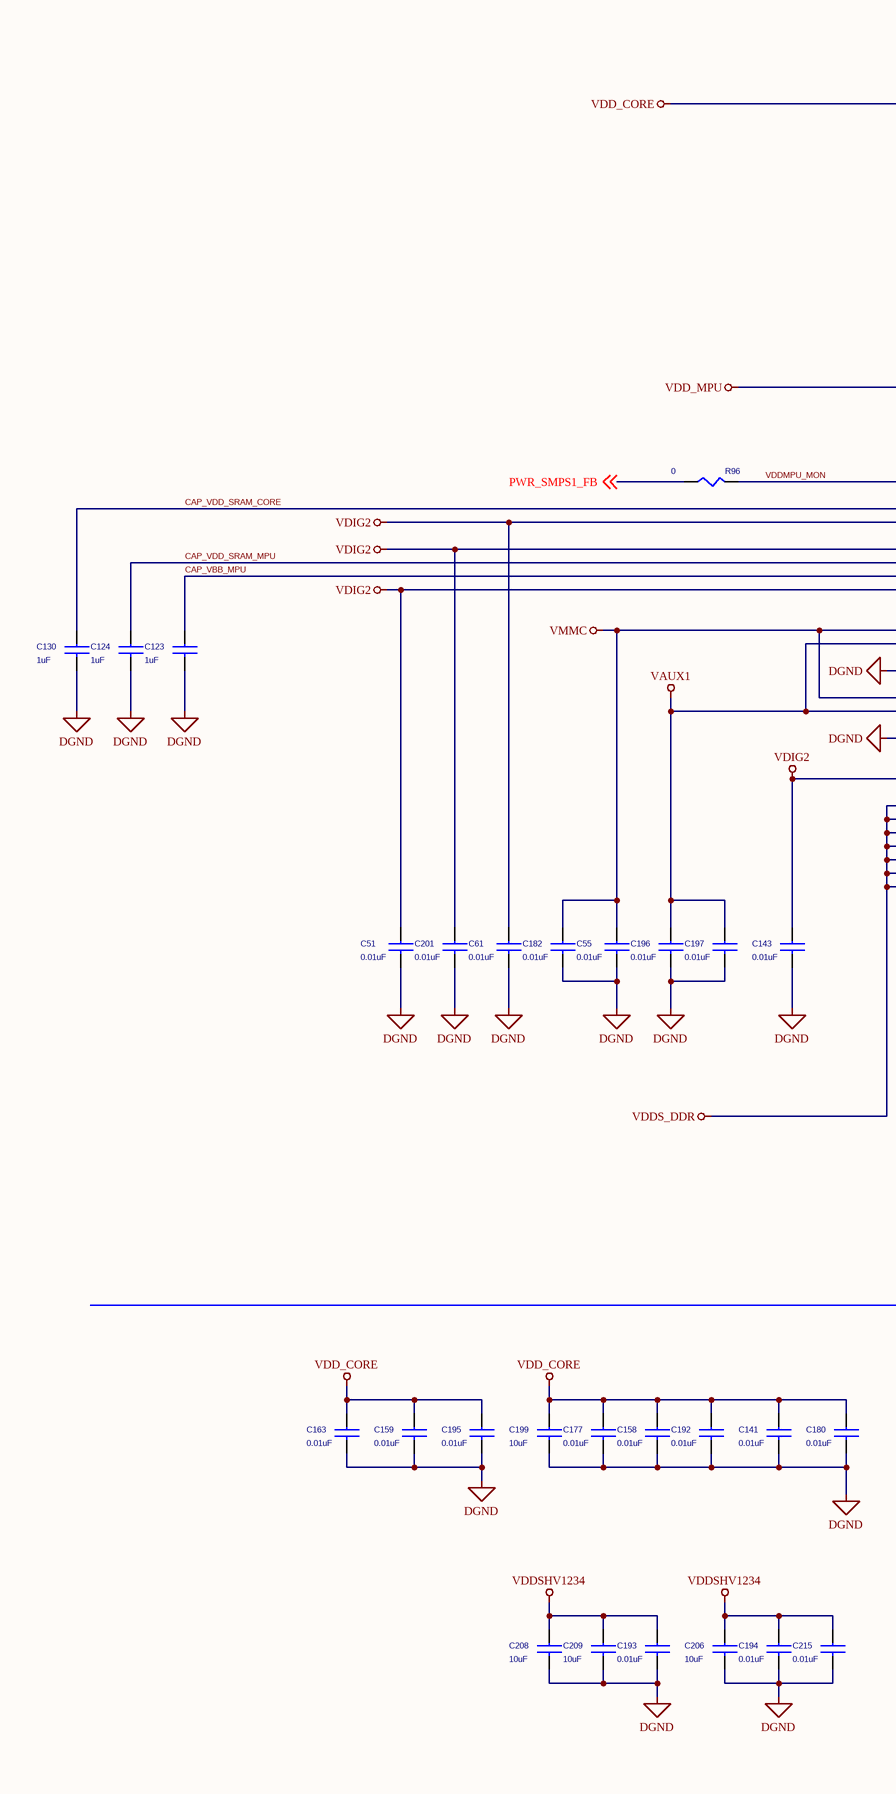
[diagram p3: Pg04_ AM335X Section 3 .SchDoc, left]
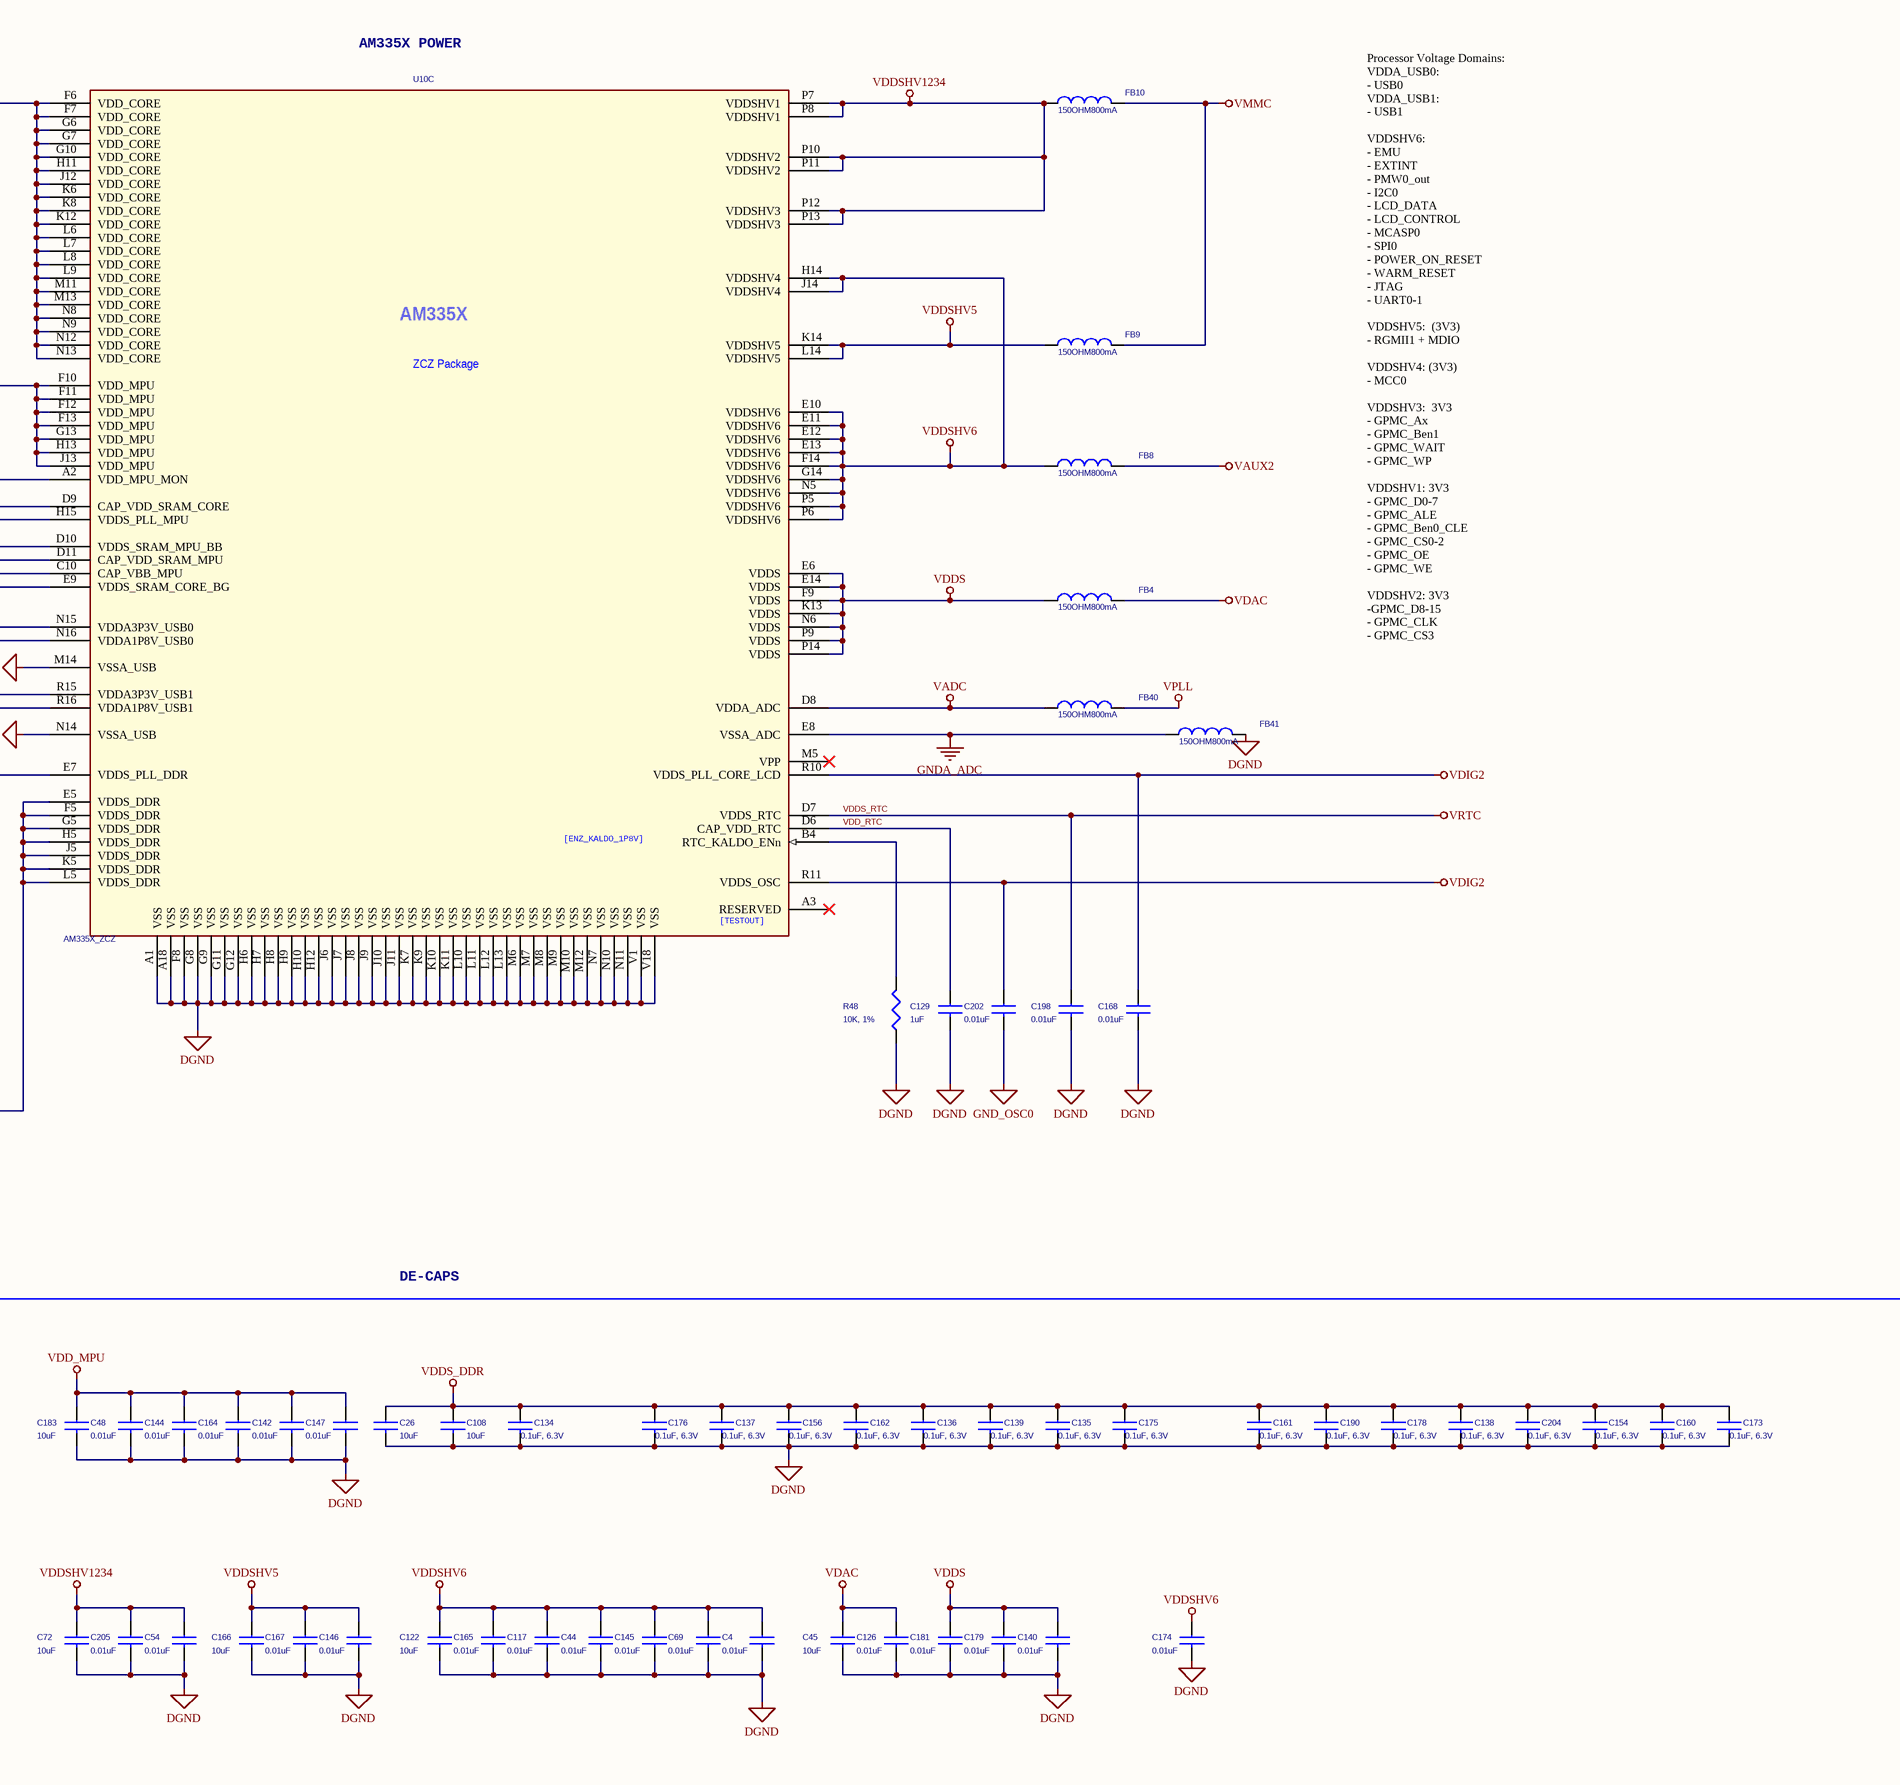
[diagram p4: Pg04_ AM335X Section 3 .SchDoc, right]

### Parts
(Parts that share a designator on the sheet are numbered #1, #2 ... from top to bottom, then left to right.)
?#4  (no value)  (graphical)
C4  0.01uF  [SM-7351-CAP-0402]
C26  10uF  [SM-7351-CAP-0805]
C44  0.01uF  [SM-7351-CAP-0402]
C45  10uF  [SM-7351-CAP-0805]
C48  0.01uF  [SM-7351-CAP-0402]
C51  0.01uF  [SM-7351-CAP-0402]
C54  0.01uF  [SM-7351-CAP-0402]
C55  0.01uF  [SM-7351-CAP-0402]
C61  0.01uF  [SM-7351-CAP-0402]
C69  0.01uF  [SM-7351-CAP-0402]
C72  10uF  [SM-7351-CAP-0805]
C108  10uF  [SM-7351-CAP-0805]
C117  0.01uF  [SM-7351-CAP-0402]
C122  10uF  [SM-7351-CAP-0805]
C123  1uF  [SM-7351-CAP-0402]
C124  1uF  [SM-7351-CAP-0402]
C126  0.01uF  [SM-7351-CAP-0402]
C129  1uF  [SM-7351-CAP-0402]
C130  1uF  [SM-7351-CAP-0402]
C134  0.1uF, 6.3V  [SM-7351-CAP-0402]
C135  0.1uF, 6.3V  [SM-7351-CAP-0402]
C136  0.1uF, 6.3V  [SM-7351-CAP-0402]
C137  0.1uF, 6.3V  [SMD0201]
C138  0.1uF, 6.3V  [SMD0201]
C139  0.1uF, 6.3V  [SMD0201]
C140  0.01uF  [SM-7351-CAP-0402]
C141  0.01uF  [SM-7351-CAP-0402]
C142  0.01uF  [SM-7351-CAP-0402]
C143  0.01uF  [SM-7351-CAP-0402]
C144  0.01uF  [SM-7351-CAP-0402]
C145  0.01uF  [SM-7351-CAP-0402]
C146  0.01uF  [SM-7351-CAP-0402]
C147  0.01uF  [SM-7351-CAP-0402]
C154  0.1uF, 6.3V  [SMD0201]
C156  0.1uF, 6.3V  [SMD0201]
C158  0.01uF  [SM-7351-CAP-0402]
C159  0.01uF  [SM-7351-CAP-0402]
C160  0.1uF, 6.3V  [SMD0201]
C161  0.1uF, 6.3V  [SMD0201]
C162  0.1uF, 6.3V  [SMD0201]
C163  0.01uF  [SM-7351-CAP-0402]
C164  0.01uF  [SM-7351-CAP-0402]
C165  0.01uF  [SM-7351-CAP-0402]
C166  10uF  [SM-7351-CAP-0805]
C167  0.01uF  [SM-7351-CAP-0402]
C168  0.01uF  [SM-7351-CAP-0402]
C173  0.1uF, 6.3V  [SMD0201]
C174  0.01uF  [SM-7351-CAP-0402]
C175  0.1uF, 6.3V  [SMD0201]
C176  0.1uF, 6.3V  [SMD0201]
C177  0.01uF  [SM-7351-CAP-0402]
C178  0.1uF, 6.3V  [SMD0201]
C179  0.01uF  [SM-7351-CAP-0402]
C180  0.01uF  [SM-7351-CAP-0402]
C181  0.01uF  [SM-7351-CAP-0402]
C182  0.01uF  [SM-7351-CAP-0402]
C183  10uF  [SM-7351-CAP-0805]
C190  0.1uF, 6.3V  [SM-7351-CAP-0402]
C192  0.01uF  [SM-7351-CAP-0402]
C193  0.01uF  [SM-7351-CAP-0402]
C194  0.01uF  [SM-7351-CAP-0402]
C195  0.01uF  [SM-7351-CAP-0402]
C196  0.01uF  [SM-7351-CAP-0402]
C197  0.01uF  [SM-7351-CAP-0402]
C198  0.01uF  [SM-7351-CAP-0402]
C199  10uF  [SM-7351-CAP-0805]
C201  0.01uF  [SM-7351-CAP-0402]
C202  0.01uF  [SM-7351-CAP-0402]
C204  0.1uF, 6.3V  [SM-7351-CAP-0402]
C205  0.01uF  [SM-7351-CAP-0402]
C206  10uF  [SM-7351-CAP-0805]
C208  10uF  [SM-7351-CAP-0805]
C209  10uF  [SM-7351-CAP-0805]
C215  0.01uF  [SM-7351-CAP-0402]
FB4  150OHM800mA  [sm-7351-ind-0805]
FB8  150OHM800mA  [sm-7351-ind-0805]
FB9  150OHM800mA  [sm-7351-ind-0805]
FB10  150OHM800mA  [sm-7351-ind-0805]
FB40  150OHM800mA  [sm-7351-ind-0805]
FB41  150OHM800mA  [sm-7351-ind-0805]
R48  10K, 1%  [SM-7351-RES-0402]
R96  0  [SM-7351-RES-0402]
U10  AM335X_ZCZ  [BGA15X15-324-55M]  (part C of 3)

### Nets
DGND: C4.2 C26.2 C44.2 C45.2 C48.2 C51.2 C54.2 C55.2 C61.2 C69.2 C72.2 C108.2 C117.2 C122.2 C123.2 C124.2 C126.2 C129.2 C130.2 C134.2 C135.2 C136.2 C137.2 C138.2 C139.2 C140.2 C141.2 C142.2 C143.2 C144.2 C145.2 C146.2 C147.2 C154.2 C156.2 C158.2 C159.2 C160.2 C161.2 C162.2 C163.2 C164.2 C165.2 C166.2 C167.2 C168.2 C173.2 C174.2 C175.2 C176.2 C177.2 C178.2 C179.2 C180.2 C181.2 C182.2 C183.2 C190.2 C192.2 C193.2 C194.2 C195.2 C196.2 C197.2 C198.2 C199.2 C201.2 C204.2 C205.2 C206.2 C208.2 C209.2 C215.2 FB41.2 R48.1 U10.A1(VSS) U10.A18(VSS) U10.F8(VSS) U10.G8(VSS) U10.G9(VSS) U10.G11(VSS) U10.G12(VSS) U10.H6(VSS) U10.H7(VSS) U10.H8(VSS) U10.H9(VSS) U10.H10(VSS) U10.H12(VSS) U10.J6(VSS) U10.J7(VSS) U10.J8(VSS) U10.J9(VSS) U10.J10(VSS) U10.J11(VSS) U10.K7(VSS) U10.K9(VSS) U10.K10(VSS) U10.K11(VSS) U10.L10(VSS) U10.L11(VSS) U10.L12(VSS) U10.L13(VSS) U10.M6(VSS) U10.M7(VSS) U10.M8(VSS) U10.M9(VSS) U10.M10(VSS) U10.M12(VSS) U10.M14(VSSA_USB) U10.N7(VSS) U10.N10(VSS) U10.N11(VSS) U10.N14(VSSA_USB) U10.V1(VSS) U10.V18(VSS)
GND_OSC0: C202.2
GNDA_ADC: FB41.1 U10.E8(VSSA_ADC)
VADC: FB40.1 U10.D8(VDDA_ADC)
VAUX1: C196.1 C197.1 U10.N16(VDDA1P8V_USB0) U10.R16(VDDA1P8V_USB1)
VAUX2: FB8.2
VDAC: C45.1 C126.1 FB4.2
VDD_CORE: C141.1 C158.1 C159.1 C163.1 C177.1 C180.1 C192.1 C195.1 C199.1 U10.F6(VDD_CORE) U10.F7(VDD_CORE) U10.G6(VDD_CORE) U10.G7(VDD_CORE) U10.G10(VDD_CORE) U10.H11(VDD_CORE) U10.J12(VDD_CORE) U10.K6(VDD_CORE) U10.K8(VDD_CORE) U10.K12(VDD_CORE) U10.L6(VDD_CORE) U10.L7(VDD_CORE) U10.L8(VDD_CORE) U10.L9(VDD_CORE) U10.M11(VDD_CORE) U10.M13(VDD_CORE) U10.N8(VDD_CORE) U10.N9(VDD_CORE) U10.N12(VDD_CORE) U10.N13(VDD_CORE)
VDD_MPU: C48.1 C142.1 C144.1 C147.1 C164.1 C183.1 U10.F10(VDD_MPU) U10.F11(VDD_MPU) U10.F12(VDD_MPU) U10.F13(VDD_MPU) U10.G13(VDD_MPU) U10.H13(VDD_MPU) U10.J13(VDD_MPU)
VDDS: C140.1 C179.1 C181.1 FB4.1 U10.E6(VDDS) U10.E14(VDDS) U10.F9(VDDS) U10.K13(VDDS) U10.N6(VDDS) U10.P9(VDDS) U10.P14(VDDS)
VDDS_DDR: C26.1 C108.1 C134.1 C135.1 C136.1 C137.1 C138.1 C139.1 C154.1 C156.1 C160.1 C161.1 C162.1 C173.1 C175.1 C176.1 C178.1 C190.1 C204.1 U10.E5(VDDS_DDR) U10.F5(VDDS_DDR) U10.G5(VDDS_DDR) U10.H5(VDDS_DDR) U10.J5(VDDS_DDR) U10.K5(VDDS_DDR) U10.L5(VDDS_DDR)
VDDS_RTC: C198.1 U10.D7(VDDS_RTC)  [also labelled VRTC]
VDDSHV5: C146.1 C166.1 C167.1 FB9.1 U10.K14(VDDSHV5) U10.L14(VDDSHV5)
VDDSHV6: C4.1 C44.1 C69.1 C117.1 C122.1 C145.1 C165.1 C174.1 FB8.1 U10.E10(VDDSHV6) U10.E11(VDDSHV6) U10.E12(VDDSHV6) U10.E13(VDDSHV6) U10.F14(VDDSHV6) U10.G14(VDDSHV6) U10.H14(VDDSHV4) U10.J14(VDDSHV4) U10.N5(VDDSHV6) U10.P5(VDDSHV6) U10.P6(VDDSHV6)
VDDSHV1234: C54.1 C72.1 C193.1 C194.1 C205.1 C206.1 C208.1 C209.1 C215.1 FB10.1 U10.P7(VDDSHV1) U10.P8(VDDSHV1) U10.P10(VDDSHV2) U10.P11(VDDSHV2) U10.P12(VDDSHV3) U10.P13(VDDSHV3)
VDIG2: C51.1 C61.1 C143.1 C168.1 C201.1 C202.1 U10.D10(VDDS_SRAM_MPU_BB) U10.E7(VDDS_PLL_DDR) U10.E9(VDDS_SRAM_CORE_BG) U10.H15(VDDS_PLL_MPU) U10.R10(VDDS_PLL_CORE_LCD) U10.R11(VDDS_OSC)
VMMC: C55.1 C182.1 FB9.2 FB10.2 U10.N15(VDDA3P3V_USB0) U10.R15(VDDA3P3V_USB1)
VPLL: FB40.2
CAP_VBB_MPU: C123.1 U10.C10(CAP_VBB_MPU)
CAP_VDD_SRAM_CORE: C130.1 U10.D9(CAP_VDD_SRAM_CORE)
CAP_VDD_SRAM_MPU: C124.1 U10.D11(CAP_VDD_SRAM_MPU)
PWR_SMPS1_FB: R96.2(P2) ; off-sheet PWR_SMPS1_FB
VDD_RTC: C129.1 U10.D6(CAP_VDD_RTC)
VDDMPU_MON: R96.1(P1) U10.A2(VDD_MPU_MON)
NetR48_2: R48.2 U10.B4(RTC_KALDO_ENn)

Not connected (* = marked no-connect by the designer): U10 A3(RESERVED)* M5(VPP)*

### Notes on the sheet
- (near U10) AM335X POWER
- Processor Voltage Domains:
  VDDA_USB0:
  - USB0
  VDDA_USB1:
  - USB1
  VDDSHV6:
  - EMU
  - EXTINT
  - PMW0_out
  - I2C0
  - LCD_DATA
  - LCD_CONTROL
  - MCASP0
  - SPI0
  - POWER_ON_RESET
  - WARM_RESET
  - JTAG
  - UART0-1
  VDDSHV5:  (3V3)
  - RGMII1 + MDIO
  VDDSHV4: (3V3)
  - MCC0
  VDDSHV3:  3V3
  - GPMC_Ax
  - GPMC_Ben1
  - GPMC_WAIT
  - GPMC_WP
  VDDSHV1: 3V3
  - GPMC_D0-7
  - GPMC_ALE
  - GPMC_Ben0_CLE
  - GPMC_CS0-2
  - GPMC_OE
  - GPMC_WE
  VDDSHV2: 3V3
  -GPMC_D8-15
  - GPMC_CLK
  - GPMC_CS3
- DE-CAPS
- Embedded Vision Systems Group
- Title
- School of Electrical and Electronic Engineering
- Date:
- Size
- Document Number
- Sheet
- of
- Rev
- (in symbol AM335X_15mmx15mm, part C) AM335X; ZCZ Package; [ENZ_KALDO_1P8V]; [TESTOUT]

### Library data of the parts
?#4 = Title Block Address(1): UoM title block
C4 C44 C48 C51 C54 C55 C61 C69 C117 C126 C140-C147 C158 C159 C163-C165 C167 C168 C174 C177 C179-C182 C192-C198 C201 C202 C205 C215 = 0.01uFCapacitor16V10%0402_Dup1: Mfr: Panasonic; PartName: 0.01uF16V10%SMD0402; MfrNum: ECJ-0YB1C103K; TIIntPartnumber: 1C0012; PN: 0402YC103KAT2A; TN: 207-0054-000; Vendor: Digikey; Cost100: 0.00; Cost10K: 0.015; DescriptiveText: Capacitor 0.01uF 16V 10% 0402
C26 C45 C72 C108 C122 C166 C183 C199 C206 C208 C209 = 10uFCapacitor16V10%0805: Capacitor 10uF 16V 10% Ceramic 0805; PartName: 10uF16V10%SMD0805; Mfr: AVX; MfrNum: 0805YD106KAT2A; TIIntPartnumber: 1C0085; Vendor: Digikey; Cost100: 0.19; Cost10K: 0.042; Descriptive_Text: Capacitor 10uF 16V 10% Ceramic 0805; DescriptiveText: Capacitor 10uF 16V 10% Ceramic 0805
C123 C124 C129 C130 = 1uFCapacitor10V10%0402_Dup1: PartName: 1uF10V10%0402; Mfr: AVX; MfrNum: 0402ZD105KAT2A; TIIntPartnumber: 1C0084; Vendor: Digikey; Cost100: 0.336; Cost10K: 0.201; DescriptiveText: Capacitor 1uF 10V Ceramic 10% 0402
C134-C139 C154 C156 C160-C162 C173 C175 C176 C178 C190 C204 = 0.1uFCapacitor6.3V10%0201: PartName: 0.1uF6.3V10%smd0201; Mfr: Murata; MfrNum: GRM033R60J104KE19D; TIIntPartnumber: 1C0122; Vendor: Digikey; Cost100: 0.029; Cost10K: 0.0090; DescriptiveText: Capacitor 0.1uF 6.3V 10% 0201 X5R
FB4 FB8 FB40 FB41 = FerBead_12: Ferrite Bead 150 Ohm 800mA; Mfr: Steward; MfrNum: LI0805H151R-10; TIIntPartnumber: 1L0010; Vendor: Digikey; Cost100: 0.068; Cost10K: 0.045; DescriptiveText: Ferrite Bead 150 Ohm 800mA; PartName: FerriteBead150ohm800mA; Descriptive_Text: Ferrite Bead 150 Ohm 800mA
FB9 = FerBead_11: Ferrite Bead 150 Ohm 800mA; Mfr: Steward; MfrNum: LI0805H151R-10; TIIntPartnumber: 1L0010; Vendor: Digikey; Cost100: 0.068; Cost10K: 0.045; DescriptiveText: Ferrite Bead 150 Ohm 800mA; PartName: FerriteBead150ohm800mA; Descriptive_Text: Ferrite Bead 150 Ohm 800mA
FB10 = FerBead_7: Ferrite Bead 150 Ohm 800mA; Mfr: Steward; MfrNum: LI0805H151R-10; TIIntPartnumber: 1L0010; Vendor: Digikey; Cost100: 0.068; Cost10K: 0.045; DescriptiveText: Ferrite Bead 150 Ohm 800mA; PartName: FerriteBead150ohm800mA; Descriptive_Text: Ferrite Bead 150 Ohm 800mA
R48 = 10KOhmResistor1/10W1%0402_Dup2: TIIntPartnumber: 1R0254; MfrNum: ERJ-2RKF1002X; Mfr: PANASONIC-ECG; PartName: 10Kohm1/10W1%smd0402; DescriptiveText: Resistor 10Kohm 1/10W 1% 0402; Cost10K: 0.00291; Cost100: 0.011; Vendor: DIGIKEY
R96 = ZeroOhmResistor1/16W0402_Dup4: as R67 on sheet Pg03_ AM335X Section 2 ; Descriptive_Text: Resistor Zero ohm Jumper 0402; DescriptiveText: Resistor Zero ohm Jumper 0402
U10 = AM335X_15mmx15mm: as U10 on sheet Pg02_ AM335X Section 1 

## Sheet Pg05_ Platform_Power.SchDoc: PLATFORM POWER
size A2; DrawnBy: RvS; DocumentNumber: 5; Revision: C2; SheetNumber: 5; SheetTotal: 16
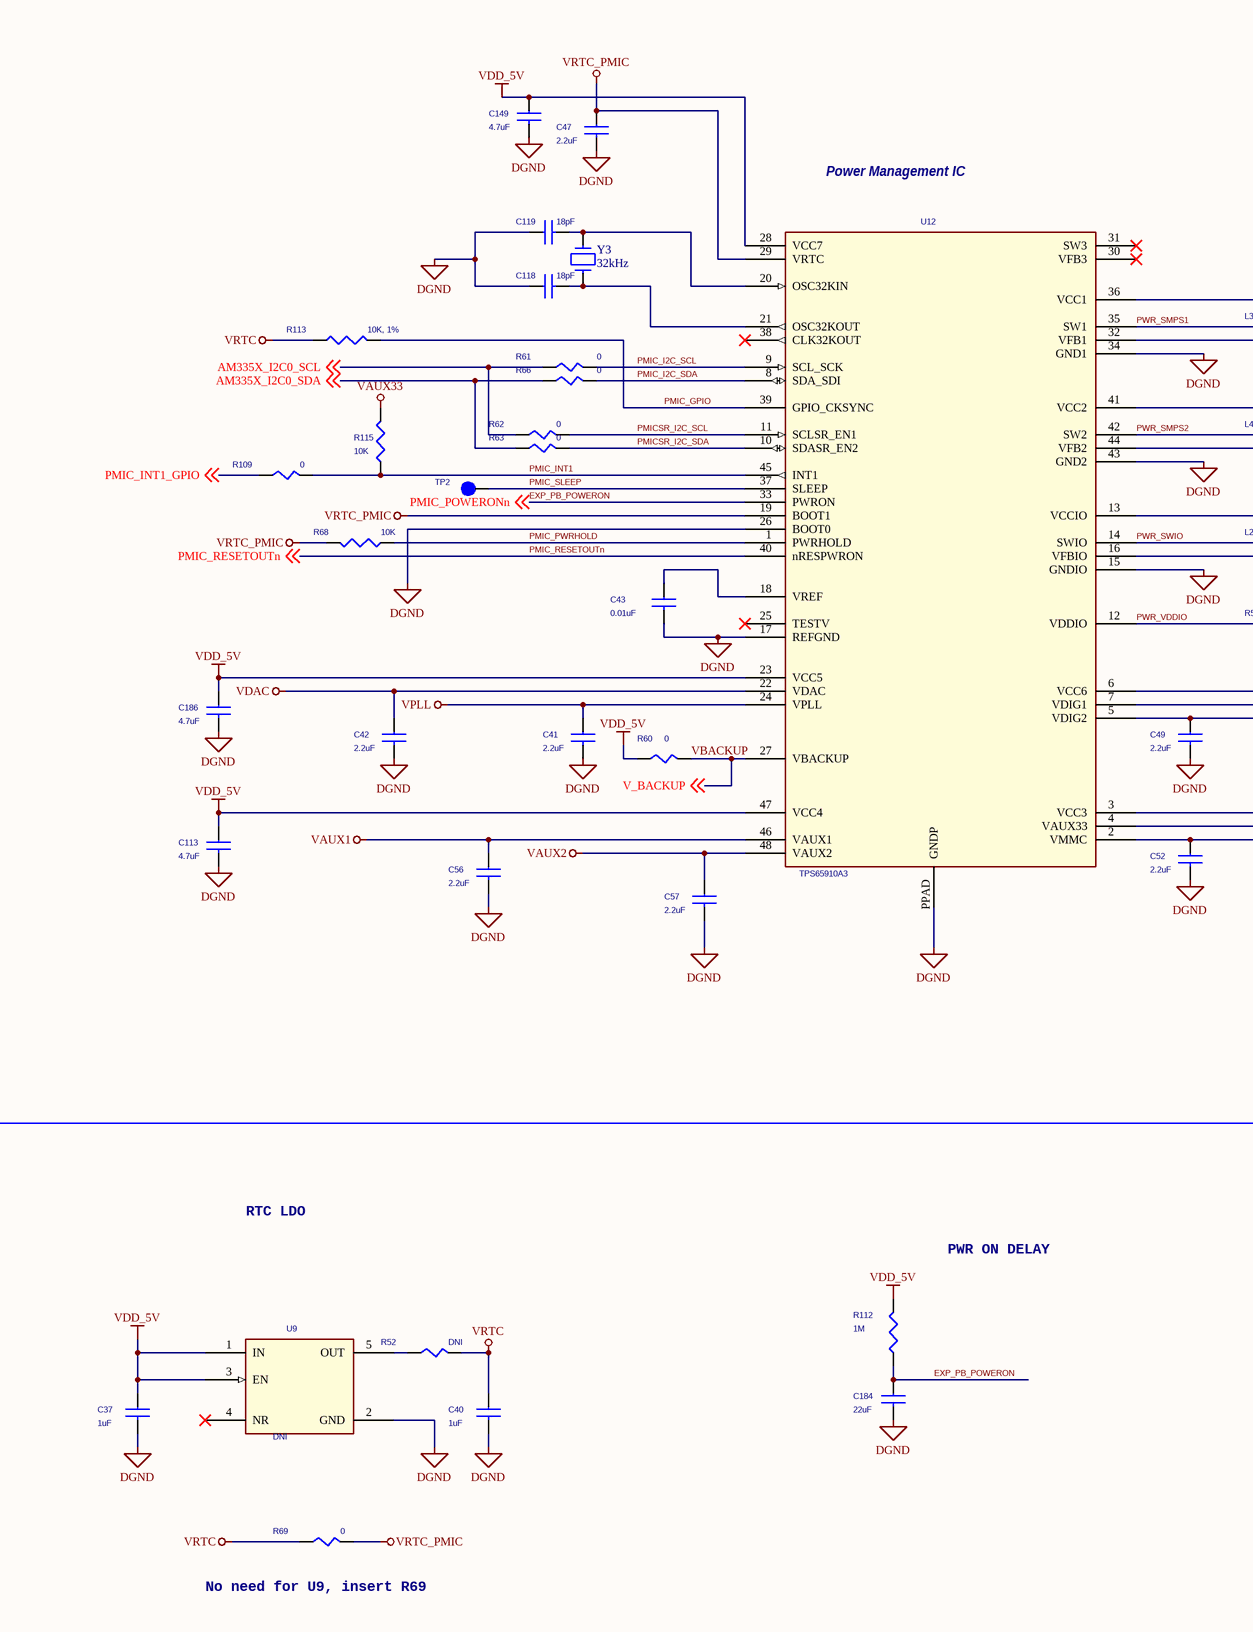
[diagram p5: Pg05_ Platform_Power.SchDoc, left]
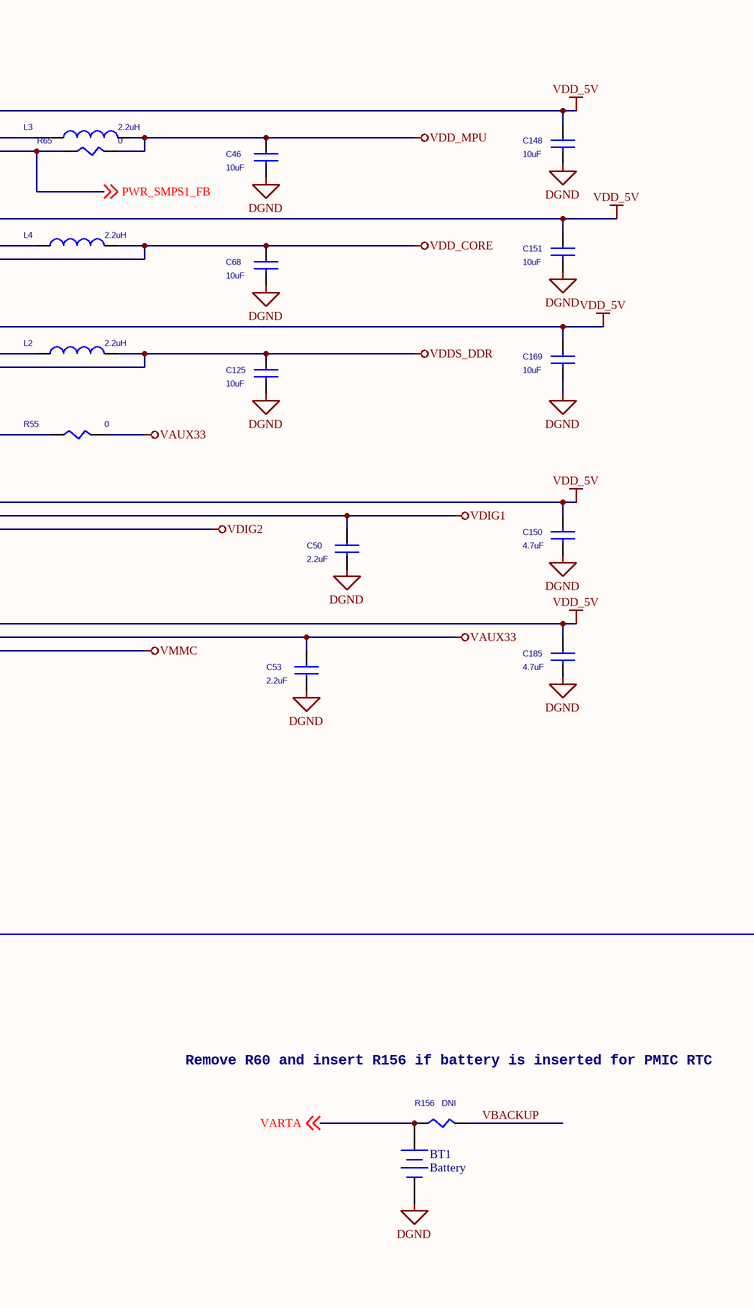
[diagram p6: Pg05_ Platform_Power.SchDoc, right]

### Parts
(Parts that share a designator on the sheet are numbered #1, #2 ... from top to bottom, then left to right.)
?#5  (no value)  (graphical)
BT1  Battery  [BAT_Varta12mm]
C37  1uF  [SM-7351-CAP-0402]
C40  1uF  [SM-7351-CAP-0402]
C41  2.2uF  [SM-7351-CAP-0402]
C42  2.2uF  [SM-7351-CAP-0402]
C43  0.01uF  [SM-7351-CAP-0402]
C46  10uF  [SM-7351-CAP-0805]
C47  2.2uF  [SM-7351-CAP-0402]
C49  2.2uF  [SM-7351-CAP-0402]
C50  2.2uF  [SM-7351-CAP-0402]
C52  2.2uF  [SM-7351-CAP-0402]
C53  2.2uF  [SM-7351-CAP-0402]
C56  2.2uF  [SM-7351-CAP-0402]
C57  2.2uF  [SM-7351-CAP-0402]
C68  10uF  [SM-7351-CAP-0805]
C113  4.7uF  [SM-7351-CAP-0603]
C118  18pF  [SM-7351-CAP-0402]
C119  18pF  [SM-7351-CAP-0402]
C125  10uF  [SM-7351-CAP-0805]
C148  10uF  [SM-7351-CAP-0805]
C149  4.7uF  [SM-7351-CAP-0603]
C150  4.7uF  [SM-7351-CAP-0603]
C151  10uF  [SM-7351-CAP-0805]
C169  10uF  [SM-7351-CAP-0805]
C184  22uF  [1206]
C185  4.7uF  [SM-7351-CAP-0603]
C186  4.7uF  [SM-7351-CAP-0603]
L2  2.2uH  [VLCF5020T]
L3  2.2uH  [VLCF5020T]
L4  2.2uH  [VLCF5020T]
R52  DNI  [SM-7351-RES-0603]
R55  0  [SM-7351-RES-0603]
R60  0  [SM-7351-RES-0402]
R61  0  [SM-7351-RES-0402]
R62  0  [SM-7351-RES-0402]
R63  0  [SM-7351-RES-0402]
R65  0  [SM-7351-RES-0402]
R66  0  [SM-7351-RES-0402]
R68  10K  [SM-7351-RES-0402]
R69  0  [SM-7351-RES-0603]
R109  0  [SM-7351-RES-0402]
R112  1M  [SM-7351-RES-0402]
R113  10K, 1%  [SM-7351-RES-0402]
R115  10K  [SM-7351-RES-0402]
R156  DNI  [SM-7351-RES-0402]
TP2  TP1mm  [tp_smd1mmcircle]  (value not drawn)
U9  DNI  [smdsc70-5]
U12  TPS65910A3  [U_48_RSL]
Y3  32kHz  [Xtal 3215]

### Nets
DGND: BT1.2(-) C37.2 C40.2 C41.2 C42.2 C43.2 C46.2 C47.2 C49.2 C50.2 C52.2 C53.2 C56.2 C57.2 C68.2 C113.2 C118.1 C119.1 C125.2 C148.2 C149.2 C150.2 C151.2 C169.2 C184.2 C185.2 C186.2 U9.2(GND) U12.15(GNDIO) U12.17(REFGND) U12.26(BOOT0) U12.34(GND1) U12.43(GND2) U12.PPAD(GNDP)
VAUX1: C56.1 U12.46(VAUX1)
VAUX2: C57.1 U12.48(VAUX2)
VAUX33: C53.1 R55.1(P1) R115.2(P2) U12.4(VAUX33)
VDAC: C42.1 U12.22(VDAC)
VDD_5V: C37.1 C113.1 C148.1 C149.1 C150.1 C151.1 C169.1 C185.1 C186.1 R60.2(P2) R112.2(P2) U9.1(IN) U9.3(EN) U12.3(VCC3) U12.6(VCC6) U12.13(VCCIO) U12.23(VCC5) U12.28(VCC7) U12.36(VCC1) U12.41(VCC2) U12.47(VCC4)
VDD_CORE: C68.1 L4.2 U12.44(VFB2)
VDD_MPU: C46.1 L3.2 R65.1(P1)
VDDS_DDR: C125.1 L2.2 U12.16(VFBIO)
VDIG1: C50.1 U12.7(VDIG1)
VDIG2: C49.1 U12.5(VDIG2)
VMMC: C52.1 U12.2(VMMC)
VPLL: C41.1 U12.24(VPLL)
VRTC: C40.1 R52.1(P1) R69.2(P2) R113.1  [project net VDDS_RTC]
VRTC_PMIC: C47.1 R68.2(P2) R69.1(P1) U12.19(BOOT1) U12.29(VRTC)
AM335X_I2C0_SCL: R61.2(P2) R62.2(P2) ; off-sheet AM335X_I2C0_SCL
AM335X_I2C0_SDA: R63.2(P2) R66.2(P2) ; off-sheet AM335X_I2C0_SDA
EXP_PB_POWERON: C184.1 R112.1(P1) U12.33(PWRON) ; off-sheet PMIC_POWERONn  [also labelled PMIC_POWERONn]
PMIC_GPIO: R113.2 U12.39(GPIO_CKSYNC)
PMIC_I2C_SCL: R61.1(P1) U12.9(SCL_SCK)
PMIC_I2C_SDA: R66.1(P1) U12.8(SDA_SDI)
PMIC_INT1: R109.1(P1) R115.1(P1) U12.45(INT1)
PMIC_INT1_GPIO: R109.2(P2) ; off-sheet PMIC_INT1_GPIO
PMIC_PWRHOLD: R68.1(P1) U12.1(PWRHOLD)
PMIC_RESETOUTn: U12.40(nRESPWRON) ; off-sheet PMIC_RESETOUTn
PMIC_SLEEP: TP2.1 U12.37(SLEEP)
PMICSR_I2C_SCL: R62.1(P1) U12.11(SCLSR_EN1)
PMICSR_I2C_SDA: R63.1(P1) U12.10(SDASR_EN2)
PWR_SMPS1: L3.1 U12.35(SW1)
PWR_SMPS1_FB: R65.2(P2) U12.32(VFB1) ; off-sheet PWR_SMPS1_FB
PWR_SMPS2: L4.1 U12.42(SW2)
PWR_SWIO: L2.1 U12.14(SWIO)
PWR_VDDIO: R55.2(P2) U12.12(VDDIO)
VARTA: BT1.1(+) R156.2(P2) ; off-sheet VARTA
VBACKUP: R60.1(P1) R156.1(P1) U12.27(VBACKUP) ; off-sheet V_BACKUP  [also labelled V_BACKUP]
NetC43_1: C43.1 U12.18(VREF)
NetC118_2: C118.2 U12.21(OSC32KOUT) Y3.1
NetC119_2: C119.2 U12.20(OSC32KIN) Y3.2
NetR52_2: R52.2(P2) U9.5(OUT)

Not connected (* = marked no-connect by the designer): U9 4(NR)*; U12 25(TESTV)* 30(VFB3)* 31(SW3)* 38(CLK32KOUT)*

### Notes on the sheet
- Power Management IC
- RTC LDO
- PWR ON DELAY
- Remove R60 and insert R156 if battery is inserted for PMIC RTC
- (near R69) No need for U9, insert R69
- Embedded Vision Systems Group
- Title
- School of Electrical and Electronic Engineering
- Date:
- Size
- Document Number
- Sheet
- of
- Rev

### Library data of the parts
?#5 = Title Block Address(1): UoM title block
BT1 = Battery: Multicell Battery; Published: 24-Mar-1999; LatestRevisionDate: 17-Jul-2002; LatestRevisionNote: Re-released for DXP Platform.; PackageReference: BAT-2; Publisher: Altium Limited
C37 C40 = 1uFCapacitor10V10%0402: TIIntPartnumber: 1C0084; MfrNum: 0402ZD105KAT2A; Mfr: AVX; PartName: 1uF10V10%0402; DescriptiveText: Capacitor 1uF 10V Ceramic 10% 0402; Cost10K: 0.201; Cost100: 0.336; Vendor: Digikey
C41 C42 C47 C49 C50 C52 C53 C56 C57 = 2.2uFCapacitor6.3V20%smdX5R0402: Capacitor 2.2uF Ceramic, 6.3V, X5R, 20%; TIIntPartnumber: 1C0091; MfrNum: JMK105BJ225MV-F; Mfr: Taiyo Yuden; PartName: 2.2uF6.3V20%smdX5R; Cost10K: 0.0516; Cost100: 0.50; Vendor: Digikey; TN: 207-0054-000; PN: 0402YC103KAT2A; DescriptiveText: Capacitor 2.2uF Ceramic, 6.3V, X5R, 20%; Descriptive_Text: Capacitor 2.2uF Ceramic, 6.3V, X5R, 20%
C43 = 0.01uFCapacitor16V10%0402_Dup1: as C4 on sheet Pg04_ AM335X Section 3 
C46 C68 C125 C148 C151 C169 C184 = 10uFCapacitor16V10%0805: as C26 on sheet Pg04_ AM335X Section 3 ; Descriptive_Text: Capacitor 10uF 16V 10% Ceramic 0805; DescriptiveText: Capacitor 10uF 16V 10% Ceramic 0805
C113 C149 C150 C185 C186 = 4.7uFCapacitor16V10%0603: TIIntPartnumber: 1C0103; MfrNum: EMK107ABJ475KA-T; Mfr: Taiyo Yuden; PartName: 4.7uF16V10%SMD0603; Cost10K: 0.00590; Cost100: 0.0198; Vendor: Digikey; DescriptiveText: Capacitor Ceramic 4.7uF 16V 10% 0603
C118 C119 = 22pFCapacitor50V10%SMD0402: as C38 on sheet Pg02_ AM335X Section 1 ; DescriptiveText: Capacitor 22pF 50V 10% 0402; Cost10K: 0.1678; Descriptive_Text: Capacitor 22pF 50V 10% 0402
L2 L4 = 2.2uHInductor10%2_1.6Asmd: PartName: 2.2uH10%2.6Asmd; Mfr: TDK; MfrNum: VLCF5020T-2R2N2R6-3; TIIntPartnumber: 1L0025; DescriptiveText: Inductor 2.2uH smt 2.6A, 58 milliohm; Vendor: Digikey; Cost100: 1.11; Cost10K: 0.3501
L3 = 2.2uHInductor10%2_0.6Asmd: PartName: 2.2uH10%2.6Asmd; Mfr: TDK; MfrNum: VLCF5020T-2R2N2R6-3; TIIntPartnumber: 1L0025; DescriptiveText: Inductor 2.2uH smt 2.6A, 58 milliohm; Vendor: Digikey; Cost100: 1.11; Cost10K: 0.3501
R52 R69 = ZeroOhmResistor1/16W0603: Resistor Zero ohm Jumper 0603; TIIntPartnumber: 1R0096; MfrNum: ERJ-3GEY0R00V; Mfr: Panasonic; PartName: ZeroohmSMD0603; Cost10K: 0.058; Cost100: 0.08; Vendor: DIGIKEY; Descriptive_Text: Resistor Zero ohm Jumper 0603; DescriptiveText: Resistor Zero ohm Jumper 0603
R55 = ZeroOhmResistor1/16W0603_Dup1: Resistor Zero ohm Jumper 0603; PartName: ZeroohmSMD0603; Mfr: Panasonic; MfrNum: ERJ-3GEY0R00V; TIIntPartnumber: 1R0096; Vendor: Digikey; Cost100: 0.08; Cost10K: 0.058; DescriptiveText: Resistor Zero ohm Jumper 0603; Descriptive_Text: Resistor Zero ohm Jumper 0603
R60-R63 R65 R66 R156 = ZeroOhmResistor1/16W0402_Dup4: as R67 on sheet Pg03_ AM335X Section 2 ; Descriptive_Text: Resistor Zero ohm Jumper 0402; DescriptiveText: Resistor Zero ohm Jumper 0402
R68 R112 R115 = 10KOhmResistor1/16W0402_Dup1: as R44 on sheet Pg02_ AM335X Section 1 ; Descriptive_Text: Resistor 10Kohm 1/16W 5% 0402; DescriptiveText: Resistor 10Kohm 1/16W 5% 0402
R109 = ZeroOhmResistor1/16W0402_Dup2: as R41 on sheet Pg03_ AM335X Section 2 ; DescriptiveText: Resistor Zero ohm Jumper 0402; Descriptive_Text: Resistor Zero ohm Jumper 0402
R113 = 10KOhmResistor1/10W1%0402_Dup2: as R48 on sheet Pg04_ AM335X Section 3 
TP2 = Testpoint_SMD1mmCircle: Testpoint SMD 1mm circle pad; TIIntPartnumber: 2H0046; Cost10K: 0.00; Cost100: 0; Descriptive_Text: Testpoint SMD 1mm circle pad; Vendor: N/A; MfrNum: N/A; Mfr: N/A; PartName: TestpointSMD1mmCircle; DescriptiveText: Testpoint SMD 1mm circle pad
U9 = TPS71718: Low Dropout 1.8V 150mA Linear Regulator; Mfr: TI; MfrNum: TPS71718DCK; TIIntPartnumber: 1A0262; Vendor: Digikey; Cost100: 1.21; Cost10K: 0.7560; DescriptiveText: Low Dropout 1.8V 150mA Linear Regulator; PartName: TPS71718; Descriptive_Text: Low Dropout 1.8V 150mA Linear Regulator
U12 = TPS65910A3: Mfr: TI; MfrNum: TPS65910A3A1RSL; TIIntPartnumber: 1A0303; DescriptiveText: Integrated Power Management Unit for DDR3; Vendor: Farnell; Cost100: 1.99; Cost10K: 1.11; Vendor Order No.: 2144288; PartName: TPS65910A3
Y3 = CRYSTAL